# Altium project SVEC.PrjPcb (part 7 of 11)

## Sheet DDR3_2.SchDoc: DDR3 memory
size 420 x 297 mm; CheckedBy: T.Janicki; CompanyName: Creotech Instruments SA; DrawnBy: G.Kasprowicz; Organization: CERN; Address1: European Organization for Nuclear Research; Address2: CH-1211 Geneve 23 - Switzerland; Revision: -; SheetNumber: 4; SheetTotal: 21; EDA_Number: EDA-xxxx; Projet: Simple VME FMC Carrier; ModifiedBy: -; CreateDate: 20/11/2012; CheckedDate: 30/04/2012; Title2: - bank 5 -; DivGrp: BE-CO; Designer: G.Kasprowicz; PageSetup: Record=PageOptions|CenterHorizontal=True|CenterVertical=True|PrintScale=0.95|XCorrection=1.00|YCorrection=1.00|PrintKind=1|BorderSize=5000000|LeftOffset=0|BottomOffset=0|Orientation=2|PaperLength=1000|PaperWidth=1000|Scale=100|PaperSource=15|PrintQuality=600|MediaType=1|DitherType=10|PaperKind=A3|PrintScaleMode=1; ModifiedDate: -
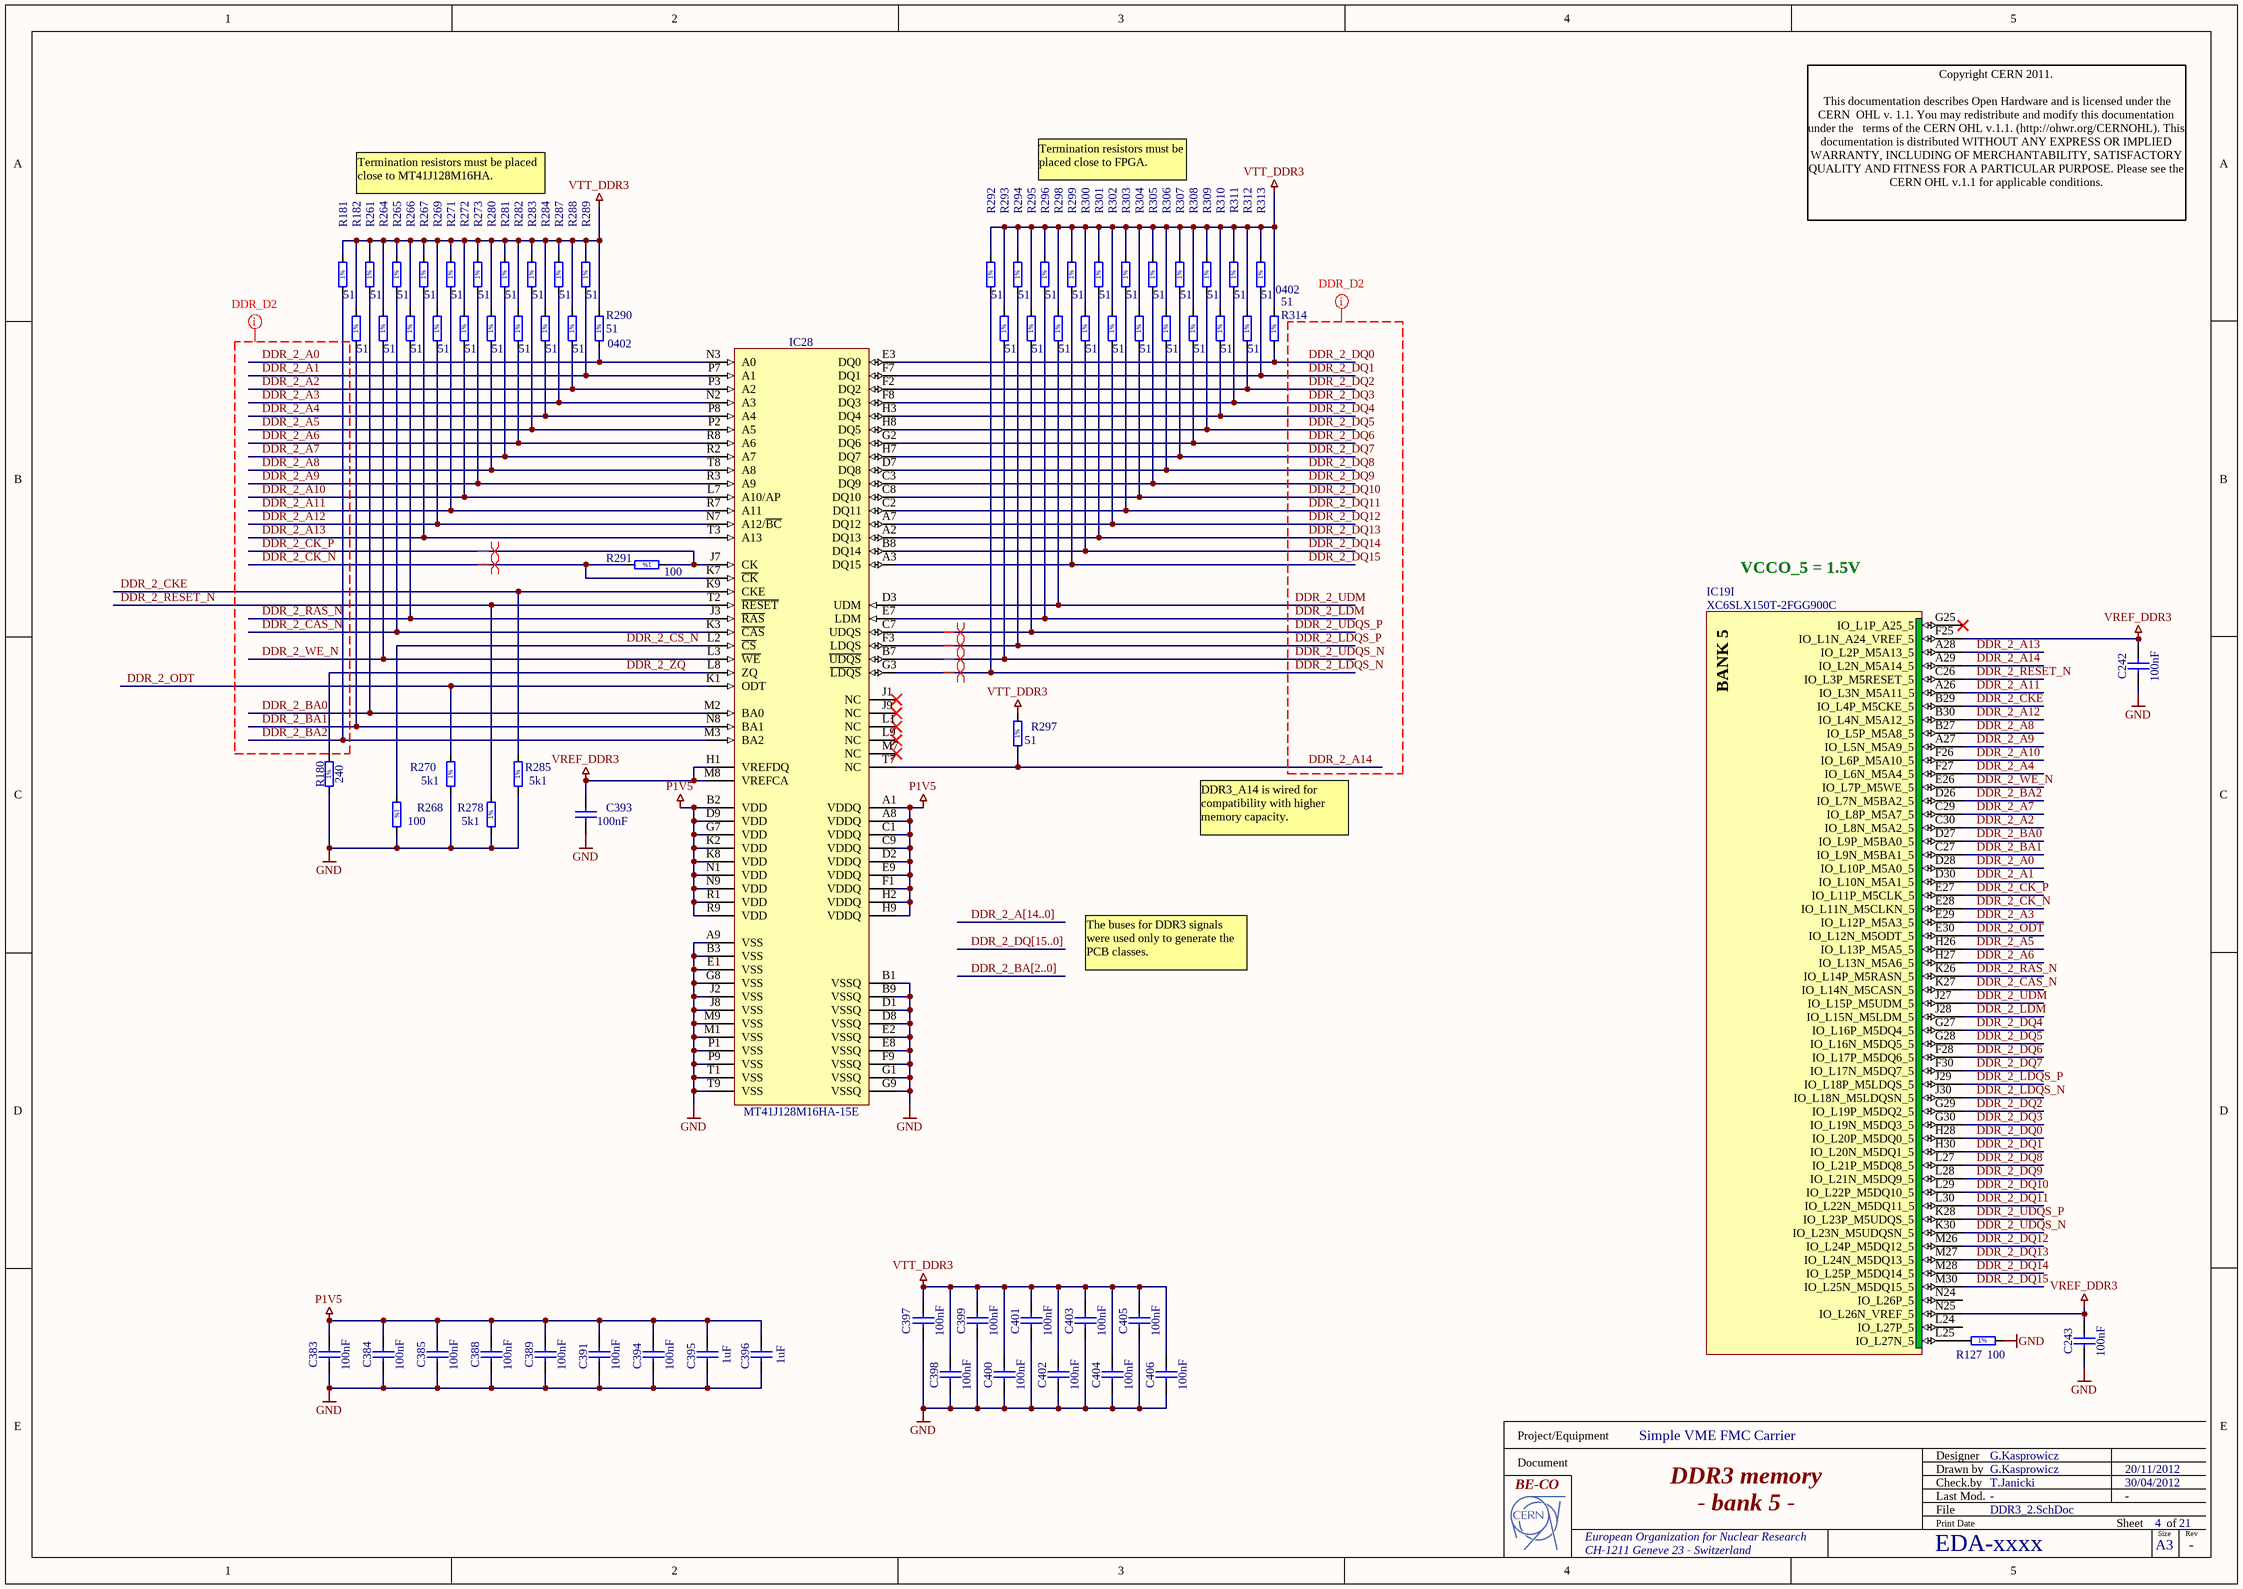
[diagram p11: DDR3_2.SchDoc]

### Parts
C242  100nF  [CAPC1005X55N]
C243  100nF  [CAPC1005X55N]
C383  100nF  [CAPC1005X55N]
C384  100nF  [CAPC1005X55N]
C385  100nF  [CAPC1005X55N]
C388  100nF  [CAPC1005X55N]
C389  100nF  [CAPC1005X55N]
C391  100nF  [CAPC1005X55N]
C393  100nF  [CAPC1005X55N]
C394  100nF  [CAPC1005X55N]
C395  1uF  [CAPC1608X87N]
C396  1uF  [CAPC1608X87N]
C397  100nF  [CAPC1005X55N]
C398  100nF  [CAPC1005X55N]
C399  100nF  [CAPC1005X55N]
C400  100nF  [CAPC1005X55N]
C401  100nF  [CAPC1005X55N]
C402  100nF  [CAPC1005X55N]
C403  100nF  [CAPC1005X55N]
C404  100nF  [CAPC1005X55N]
C405  100nF  [CAPC1005X55N]
C406  100nF  [CAPC1005X55N]
IC19  XC6SLX150T-2FGG900C  [BGA900C100P30X30_3100X3100X260]  (part I of 18)
IC28  MT41J128M16HA-15E  [BGA96C80P9X16_900X1400X120]
R127  100  [RESC1608X55N]
R180  240  [RESC1608X55N]
R181  51  [RESC1005X40N]
R182  51  [RESC1005X40N]
R261  51  [RESC1005X40N]
R264  51  [RESC1005X40N]
R265  51  [RESC1005X40N]
R266  51  [RESC1005X40N]
R267  51  [RESC1005X40N]
R268  100  [RESC1608X55N]
R269  51  [RESC1005X40N]
R270  5k1  [RESC1608X55N]
R271  51  [RESC1005X40N]
R272  51  [RESC1005X40N]
R273  51  [RESC1005X40N]
R278  5k1  [RESC1608X55N]
R280  51  [RESC1005X40N]
R281  51  [RESC1005X40N]
R282  51  [RESC1005X40N]
R283  51  [RESC1005X40N]
R284  51  [RESC1005X40N]
R285  5k1  [RESC1608X55N]
R287  51  [RESC1005X40N]
R288  51  [RESC1005X40N]
R289  51  [RESC1005X40N]
R290  51  Case: 0402  [RESC1005X40N]
R291  100  [RESC1608X55N]
R292  51  [RESC1005X40N]
R293  51  [RESC1005X40N]
R294  51  [RESC1005X40N]
R295  51  [RESC1005X40N]
R296  51  [RESC1005X40N]
R297  51  [RESC1005X40N]
R298  51  [RESC1005X40N]
R299  51  [RESC1005X40N]
R300  51  [RESC1005X40N]
R301  51  [RESC1005X40N]
R302  51  [RESC1005X40N]
R303  51  [RESC1005X40N]
R304  51  [RESC1005X40N]
R305  51  [RESC1005X40N]
R306  51  [RESC1005X40N]
R307  51  [RESC1005X40N]
R308  51  [RESC1005X40N]
R309  51  [RESC1005X40N]
R310  51  [RESC1005X40N]
R311  51  [RESC1005X40N]
R312  51  [RESC1005X40N]
R313  51  [RESC1005X40N]
R314  51  Case: 0402  [RESC1005X40N]

### Nets
GND: C242.1 C243.1 C383.1 C384.1 C385.1 C388.1 C389.1 C391.1 C393.1 C394.1 C395.1 C396.1 C397.1 C398.1 C399.1 C400.1 C401.1 C402.1 C403.1 C404.1 C405.1 C406.1 IC28.A9(VSS) IC28.B1(VSSQ) IC28.B3(VSS) IC28.B9(VSSQ) IC28.D1(VSSQ) IC28.D8(VSSQ) IC28.E1(VSS) IC28.E2(VSSQ) IC28.E8(VSSQ) IC28.F9(VSSQ) IC28.G1(VSSQ) IC28.G8(VSS) IC28.G9(VSSQ) IC28.J2(VSS) IC28.J8(VSS) IC28.M1(VSS) IC28.M9(VSS) IC28.P1(VSS) IC28.P9(VSS) IC28.T1(VSS) IC28.T9(VSS) R127.2 R180.1 R268.2 R270.1 R278.1 R285.1
P1V5: C383.2 C384.2 C385.2 C388.2 C389.2 C391.2 C394.2 C395.2 C396.2 IC28.A1(VDDQ) IC28.A8(VDDQ) IC28.B2(VDD) IC28.C1(VDDQ) IC28.C9(VDDQ) IC28.D2(VDDQ) IC28.D9(VDD) IC28.E9(VDDQ) IC28.F1(VDDQ) IC28.G7(VDD) IC28.H2(VDDQ) IC28.H9(VDDQ) IC28.K2(VDD) IC28.K8(VDD) IC28.N1(VDD) IC28.N9(VDD) IC28.R1(VDD) IC28.R9(VDD)
VREF_DDR3: C242.2 C243.2 C393.2 IC19.F25(IO_L1N_A24_VREF_5) IC19.N25(IO_L26N_VREF_5) IC28.H1(VREFDQ) IC28.M8(VREFCA)
VTT_DDR3: C397.2 C398.2 C399.2 C400.2 C401.2 C402.2 C403.2 C404.2 C405.2 C406.2 R181.2 R182.2 R261.2 R264.2 R265.2 R266.2 R267.2 R269.2 R271.2 R272.2 R273.2 R280.2 R281.2 R282.2 R283.2 R284.2 R287.2 R288.2 R289.2 R290.2 R292.2 R293.2 R294.2 R295.2 R296.2 R297.2 R298.2 R299.2 R300.2 R301.2 R302.2 R303.2 R304.2 R305.2 R306.2 R307.2 R308.2 R309.2 R310.2 R311.2 R312.2 R313.2 R314.2
DDR_2_A0: IC19.D28(IO_L10P_M5A0_5) IC28.N3(A0) R290.1
DDR_2_A1: IC19.D30(IO_L10N_M5A1_5) IC28.P7(A1) R289.1
DDR_2_A2: IC19.C30(IO_L8N_M5A2_5) IC28.P3(A2) R288.1
DDR_2_A3: IC19.E29(IO_L12P_M5A3_5) IC28.N2(A3) R287.1
DDR_2_A4: IC19.F27(IO_L6N_M5A4_5) IC28.P8(A4) R284.1
DDR_2_A5: IC19.H26(IO_L13P_M5A5_5) IC28.P2(A5) R283.1
DDR_2_A6: IC19.H27(IO_L13N_M5A6_5) IC28.R8(A6) R282.1
DDR_2_A7: IC19.C29(IO_L8P_M5A7_5) IC28.R2(A7) R281.1
DDR_2_A8: IC19.B27(IO_L5P_M5A8_5) IC28.T8(A8) R280.1
DDR_2_A9: IC19.A27(IO_L5N_M5A9_5) IC28.R3(A9) R273.1
DDR_2_A10: IC19.F26(IO_L6P_M5A10_5) IC28.L7(A10/AP) R272.1
DDR_2_A11: IC19.A26(IO_L3N_M5A11_5) IC28.R7(A11) R271.1
DDR_2_A12: IC19.B30(IO_L4N_M5A12_5) IC28.N7(A12/~{BC}) R269.1
DDR_2_A13: IC19.A28(IO_L2P_M5A13_5) IC28.T3(A13) R267.1
DDR_2_A14: IC19.A29(IO_L2N_M5A14_5) IC28.T7(NC) R297.1
DDR_2_BA0: IC19.D27(IO_L9P_M5BA0_5) IC28.M2(BA0) R261.1
DDR_2_BA1: IC19.C27(IO_L9N_M5BA1_5) IC28.N8(BA1) R182.1
DDR_2_BA2: IC19.D26(IO_L7N_M5BA2_5) IC28.M3(BA2) R181.1
DDR_2_CAS_N: IC19.K27(IO_L14N_M5CASN_5) IC28.K3(~{CAS}) R265.1
DDR_2_CK_N: IC19.E28(IO_L11N_M5CLKN_5) IC28.K7(~{CK}) R291.2
DDR_2_CK_P: IC19.E27(IO_L11P_M5CLK_5) IC28.J7(CK) R291.1
DDR_2_CKE: IC19.B29(IO_L4P_M5CKE_5) IC28.K9(CKE) R285.2
DDR_2_CS_N: IC28.L2(~{CS}) R268.1
DDR_2_DQ0: IC19.H28(IO_L20P_M5DQ0_5) IC28.E3(DQ0) R314.1
DDR_2_DQ1: IC19.H30(IO_L20N_M5DQ1_5) IC28.F7(DQ1) R313.1
DDR_2_DQ2: IC19.G29(IO_L19P_M5DQ2_5) IC28.F2(DQ2) R312.1
DDR_2_DQ3: IC19.G30(IO_L19N_M5DQ3_5) IC28.F8(DQ3) R311.1
DDR_2_DQ4: IC19.G27(IO_L16P_M5DQ4_5) IC28.H3(DQ4) R310.1
DDR_2_DQ5: IC19.G28(IO_L16N_M5DQ5_5) IC28.H8(DQ5) R309.1
DDR_2_DQ6: IC19.F28(IO_L17P_M5DQ6_5) IC28.G2(DQ6) R308.1
DDR_2_DQ7: IC19.F30(IO_L17N_M5DQ7_5) IC28.H7(DQ7) R307.1
DDR_2_DQ8: IC19.L27(IO_L21P_M5DQ8_5) IC28.D7(DQ8) R306.1
DDR_2_DQ9: IC19.L28(IO_L21N_M5DQ9_5) IC28.C3(DQ9) R305.1
DDR_2_DQ10: IC19.L29(IO_L22P_M5DQ10_5) IC28.C8(DQ10) R304.1
DDR_2_DQ11: IC19.L30(IO_L22N_M5DQ11_5) IC28.C2(DQ11) R303.1
DDR_2_DQ12: IC19.M26(IO_L24P_M5DQ12_5) IC28.A7(DQ12) R302.1
DDR_2_DQ13: IC19.M27(IO_L24N_M5DQ13_5) IC28.A2(DQ13) R301.1
DDR_2_DQ14: IC19.M28(IO_L25P_M5DQ14_5) IC28.B8(DQ14) R300.1
DDR_2_DQ15: IC19.M30(IO_L25N_M5DQ15_5) IC28.A3(DQ15) R299.1
DDR_2_LDM: IC19.J28(IO_L15N_M5LDM_5) IC28.E7(LDM) R296.1
DDR_2_LDQS_N: IC19.J30(IO_L18N_M5LDQSN_5) IC28.G3(~{LDQS}) R292.1
DDR_2_LDQS_P: IC19.J29(IO_L18P_M5LDQS_5) IC28.F3(LDQS) R294.1
DDR_2_ODT: IC19.E30(IO_L12N_M5ODT_5) IC28.K1(ODT) R270.2
DDR_2_RAS_N: IC19.K26(IO_L14P_M5RASN_5) IC28.J3(~{RAS}) R266.1
DDR_2_RESET_N: IC19.C26(IO_L3P_M5RESET_5) IC28.T2(~{RESET}) R278.2
DDR_2_UDM: IC19.J27(IO_L15P_M5UDM_5) IC28.D3(UDM) R298.1
DDR_2_UDQS_N: IC19.K30(IO_L23N_M5UDQSN_5) IC28.B7(~{UDQS}) R293.1
DDR_2_UDQS_P: IC19.K28(IO_L23P_M5UDQS_5) IC28.C7(UDQS) R295.1
DDR_2_WE_N: IC19.E26(IO_L7P_M5WE_5) IC28.L3(~{WE}) R264.1
DDR_2_ZQ: IC28.L8(ZQ) R180.2
NetIC19_L25: IC19.L25(IO_L27N_5) R127.1

Not connected (* = marked no-connect by the designer): IC19 G25(IO_L1P_A25_5)* L24(IO_L27P_5) N24(IO_L26P_5); IC28 J1(NC)* J9(NC)* L1(NC)* L9(NC)* M7(NC)*

### Buses and harness runs
bus DDR_2_A[14..0]
bus DDR_2_BA[2..0]
bus DDR_2_DQ[15..0]

### Layout directives
differential pair: DDR_2_CK_N, DDR_2_CK_P, DDR_2_LDQS_N, DDR_2_LDQS_P, DDR_2_UDQS_N, DDR_2_UDQS_P
net class DDR_D2: DDR_2_A0, DDR_2_A1, DDR_2_A2, DDR_2_A3, DDR_2_A4, DDR_2_A5, DDR_2_A6, DDR_2_A7, DDR_2_A8, DDR_2_A9, DDR_2_A10, DDR_2_A11, DDR_2_A12, DDR_2_A13, DDR_2_A14, DDR_2_BA0, DDR_2_BA1, DDR_2_BA2, DDR_2_CAS_N, DDR_2_CK_N, DDR_2_CK_P, DDR_2_DQ0, DDR_2_DQ1, DDR_2_DQ2, DDR_2_DQ3, DDR_2_DQ4, DDR_2_DQ5, DDR_2_DQ6, DDR_2_DQ7, DDR_2_DQ8, DDR_2_DQ9, DDR_2_DQ10, DDR_2_DQ11, DDR_2_DQ12, DDR_2_DQ13, DDR_2_DQ14, DDR_2_DQ15, DDR_2_LDM, DDR_2_LDQS_N, DDR_2_LDQS_P, DDR_2_RAS_N, DDR_2_UDM, DDR_2_UDQS_N, DDR_2_UDQS_P, DDR_2_WE_N

### Notes on the sheet
- Termination resistors must be placed close to MT41J128M16HA.
- Termination resistors must be placed close to FPGA.
- Copyright CERN 2011.
  This documentation describes Open Hardware and is licensed under the CERN  OHL v. 1.1. You may redistribute and modify this documentation under the   terms of the CERN OHL v.1.1. (http://ohwr.org/CERNOHL). This  documentation is distributed WITHOUT ANY EXPRESS OR IMPLIED  WARRANTY, INCLUDING OF MERCHANTABILITY, SATISFACTORY  QUALITY AND FITNESS FOR A PARTICULAR PURPOSE. Please see the  CERN OHL v.1.1 for applicable conditions.
- VCCO_5 = 1.5V
- DDR3_A14 is wired for compatibility with higher memory capacity.
- The buses for DDR3 signals were used only to generate the PCB classes.
- Project/Equipment
- Document
- Designer
- Drawn by
- Check.by
- File
- Last Mod.
- Print Date
- Sheet
- Size
- A3
- of
- Rev
- (in symbol R0402_51R_1%_0.0625W_100PPM) 1%
- (in symbol R0603_5K1_1%_0.1W_100PPM) 1%
- (in symbol R0603_100R_1%_0.1W_100PPM) 1%
- (in symbol R0603_240R_1%_0.1W_100PPM) 1%
- (in symbol XC6SLX150T-2FGG900C, part I) BANK 5

### Library data of the parts
C242 C243 C391 C394 = CC0402_100NF_16V_10%_X7R: Non-polarised capacitor; Part Description: SMD Multilayer Chip Ceramic Capacitor; Manufacturer: GENERIC; Manufacturer1 Part Number: 223878715649; Voltage: 16V; TC: X7R; Tolerance: ±10%; Table: Capacitors SMD; Part Number: CC0402_100NF_16V_10%_X7R; Component Kind: Standard; Component Type: Standard; Pin Count: 2; Value: 100nF; Status: Not Recommended; Manufacturer Part Number: CC0402_100NF_16V_10%_X7R; Case: 0402; Mounted: Yes; Socket: No; SMD: Yes; Manufacturer1 Example: PHYCOMP; Manufacturer1 ComponentHeight: 0.55mm; HelpURL: \\cern.ch\dfs\Applications\Altium\Datasheets\CC0402_X7R_PHYCOMP.pdf; Author: CERN DEM JLC; CreateDate: 03/12/2007; LatestRevisionDate: 03/12/2007
C383-C385 C388 C389 C393 C397-C406 = CC0402_100NF_16V_10%_X7R: Non-polarised capacitor; Part Description: SMD Multilayer Chip Ceramic Capacitor; Manufacturer: GENERIC; Manufacturer1 Part Number: 223878715649; Manufacturer1 Datasheet: \\cern.ch\dfs\Applications\Altium\Datasheets\CC0402_X7R_PHYCOMP.pdf; Voltage: 16V; TC: X7R; Tolerance: ±10%; Table: Capacitors SMD; Part Number: CC0402_100NF_16V_10%_X7R; Component Kind: Standard; Component Type: Standard; Designator: Capacitor - non polarized; Library Reference: Capacitor - non polarized; Pin Count: 2; Value: 100nF; Status: Not Recommended; Manufacturer Part Number: CC0402_100NF_16V_10%_X7R; Case: 0402; Mounted: Yes; Socket: No; SMD: Yes; Manufacturer1 Example: PHYCOMP; Manufacturer1 ComponentHeight: 0.55mm; HelpURL: \\cern.ch\dfs\Applications\Altium\Datasheets\CC0402_X7R_PHYCOMP.pdf; Author: CERN DEM JLC; CreateDate: 12/3/2007; LatestRevisionDate: 12/3/2007
C395 C396 = CC0603_1UF_16V_10%_X7R: Non-polarised capacitor; Part Description: SMD Multilayer Chip Ceramic Capacitor; Manufacturer: GENERIC; Manufacturer1 Part Number: 223824613663; Voltage: 16V; TC: X7R; Tolerance: ±10%; Table: Capacitors SMD; Part Number: CC0603_1UF_16V_10%_X7R; Component Kind: Standard; Component Type: Standard; Pin Count: 2; Value: 1uF; Status: Preferred; Manufacturer Part Number: CC0603_1uF_16V_10%_X7R; Case: 0603; Mounted: Yes; Socket: No; SMD: Yes; Manufacturer1 Example: PHYCOMP; Manufacturer1 ComponentHeight: 0.87mm; HelpURL: \\cern.ch\dfs\Applications\Altium\Datasheets\CC0805_X5R_PHYCOMP_HC.pdf; Author: CERN DEM JLC; CreateDate: 03/12/2007; LatestRevisionDate: 03/12/2007
IC19 = XC6SLX150T-2FGG900C: SPARTAN-6, FPGA, 900-Ball BGA, Commercial Grade, Pb-Free; Part Description: SPARTAN-6, FPGA, 540 User I/Os, 8 GTPs, 900-Ball BGA, Commercial Grade, Pb-Free; Manufacturer: XILINX; Table: Logic; Part Number: XC6SLX150T-2FGG900C; Component Kind: Standard; Component Type: Standard; Device: XC6SLX150T-2FGG900C; PackageDescription: BGA,1.00mm pitch, square; 900 pin, 30 columns X 30 rows, 31.00mm X 31.00mm X 2.60mm H, IPC Medium Density; Manufacturer Part Number: XC6SLX150T-2FGG900C; Pin Count: 900; Case: BGA900; Mounted: Yes; Socket: No; SMD: Yes; ComponentHeight: 2.6mm; HelpURL: \\cern.ch\dfs\Applications\Altium\Datasheets\XC6SLX150T-2FGG900C.pdf; ComponentLink1URL: \\cern.ch\dfs\Applications\Altium\Datasheets\XC6SLX150T-2FGG900C_Package-Pinouts.pdf; ComponentLink1Description: Package/Pinouts; Author: CERN DEM JLC; CreateDate: 2009-11-17; LatestRevisionDate: 2009-11-17
IC28 = MT41J128M16HA-15E: 16 Meg x 16 x 8 Banks DDR3 SDRAM; Part Description: 16 Meg x 16 x 8 Banks DDR3 SDRAM, +1.5V Supply; Manufacturer: MICRON TECHNOLOGY; Table: Logic; Part Number: MT41J128M16HA-15E; Component Kind: Standard; Component Type: Standard; Designator: MT41J128M16HA; Device: MT41J128M16HA-15E; Library Reference: MT41J128M16HA; PackageDescription: BGA 0.8mm, Pitch, Square 96 Pin, 9 Columns x 16 Rows, Body 14mm X 9mm X 1.2mm H; Manufacturer Part Number: MT41J128M16HA-15E; Pin Count: 96; Case: BGA96; Mounted: Yes; Socket: No; SMD: Yes; ComponentHeight: 1.2mm; Datasheet: \\cern.ch\dfs\Applications\Altium\Datasheets\MT41J128M16HA-15E.pdf; HelpURL: \\cern.ch\dfs\Applications\Altium\Datasheets\MT41J128M16HA-15E.pdf; Author: CERN DEM JLC; CreateDate: 11/19/2009; LatestRevisionDate: 11/19/2009
R127 R268 R291 = R0603_100R_1%_0.1W_100PPM: Resistor - 1%; Part Description: General Purpose Thick Film Chip Resistor; Manufacturer: GENERIC; Manufacturer1 Part Number: NRC06F4700TRF; Power: 0.1W; TC: ±100ppm/°C; Table: Resistors SMD; Part Number: R0603_100R_1%_0.1W_100PPM; Component Kind: Standard; Component Type: Standard; Pin Count: 2; Value: 100; Status: Preferred; Tolerance: ±1%; Manufacturer Part Number: R0603_100R_1%_0.1W_100PPM; Case: 0603; Mounted: Yes; Socket: No; SMD: Yes; Manufacturer1 Example: NIC COMPONENT; Manufacturer1 ComponentHeight: 0.55mm; HelpURL: \\cern.ch\dfs\Applications\Altium\Datasheets\R0603_NIC_NRC.pdf; Author: CERN DEM JLC; CreateDate: 2007-12-03; LatestRevisionDate: 2008-03-13
R180 = R0603_240R_1%_0.1W_100PPM: Resistor - 1%; Part Description: General Purpose Thick Film Chip Resistor; Manufacturer: GENERIC; Manufacturer1 Part Number: NRC06F2400TRF; Power: 0.1W; TC: ±100ppm/°C; Table: Resistors SMD; Part Number: R0603_240R_1%_0.1W_100PPM; Component Kind: Standard; Component Type: Standard; Pin Count: 2; Value: 240; Status: Preferred; Tolerance: ±1%; Manufacturer Part Number: R0603_240R_1%_0.1W_100PPM; Case: 0603; Mounted: Yes; Socket: No; SMD: Yes; Manufacturer1 Example: NIC COMPONENT; Manufacturer1 ComponentHeight: 0.55mm; HelpURL: \\cern.ch\dfs\Applications\Altium\Datasheets\R0603_NIC_NRC.pdf; Author: CERN DEM JLC; CreateDate: 12/3/2007; LatestRevisionDate: 3/13/2008
R181 R182 R261 R264-R267 R269 R271-R273 R280-R284 R287-R290 R292-R314 = R0402_51R_1%_0.0625W_100PPM: Resistor - 1%; Part Description: General Purpose Thick Film Chip Resistor; Manufacturer: GENERIC; Manufacturer1 Part Number: 232270675109; TC: ±100ppm/°C; Table: Resistors SMD; Part Number: R0402_51R_1%_0.0625W_100PPM; Component Kind: Standard; Component Type: Standard; Pin Count: 2; Value: 51; Status: Not recommended; Power: 0.0625W; Tolerance: ±1%; Manufacturer Part Number: R0402_51R_1%_0.0625W_100PPM; Mounted: Yes; Socket: No; SMD: Yes; Manufacturer1 Example: PHYCOMP; Manufacturer1 ComponentHeight: 0.4mm; HelpURL: \\cern.ch\dfs\Applications\Altium\Datasheets\R0402_Phycomp_RC0402.pdf; Author: CERN DEM JLC; CreateDate: 03/12/2007; LatestRevisionDate: 13/03/2008
  R181 R182 R261 R264-R267 R269 R271-R273 R280-R284 R287-R289 R292-R313: Case: 0402
R270 R278 R285 = R0603_5K1_1%_0.1W_100PPM: Resistor - 1%; Part Description: General Purpose Thick Film Chip Resistor; Manufacturer: GENERIC; Manufacturer1 Part Number: NRC06F5101TRF; Power: 0.1W; TC: ±100ppm/°C; Table: Resistors SMD; Part Number: R0603_5K1_1%_0.1W_100PPM; Component Kind: Standard; Component Type: Standard; Pin Count: 2; Value: 5k1; Status: Preferred; Tolerance: ±1%; Manufacturer Part Number: R0603_5K1_1%_0.1W_100PPM; Case: 0603; Mounted: Yes; Socket: No; SMD: Yes; Manufacturer1 Example: NIC COMPONENT; Manufacturer1 ComponentHeight: 0.55mm; HelpURL: \\cern.ch\dfs\Applications\Altium\Datasheets\R0603_NIC_NRC.pdf; Author: CERN DEM JLC; CreateDate: 03/12/2007; LatestRevisionDate: 13/03/2008

## Sheet AFPGA_VME_IO_banks1+3.SchDoc: AFPGA VME & IO
size 420 x 297 mm; CheckedBy: T.Janicki; CompanyName: Creotech Instruments SA; DrawnBy: G.Kasprowicz; Organization: CERN; Address1: European Organization for Nuclear Research; Address2: CH-1211 Genève 23 - Switzerland; Revision: -; SheetNumber: 7; SheetTotal: 19; EDA_Number: EDA-xxxx; Projet: Simple VME FMC Carrier; ModifiedBy: -; CreateDate: 20/11/2012; CheckedDate: 23/01/2012; Title2: - banks 1 & 3 -; DivGrp: BE-CO; Designer: G.Kasprowicz; PageSetup: Record=PageOptions|CenterHorizontal=True|CenterVertical=True|PrintScale=0.95|XCorrection=1.00|YCorrection=1.00|PrintKind=1|BorderSize=5000000|LeftOffset=0|BottomOffset=0|Orientation=2|PaperLength=1000|PaperWidth=1000|Scale=100|PaperSource=15|PrintQuality=600|MediaType=1|DitherType=10|PaperKind=A3|PrintScaleMode=1; ModifiedDate: -
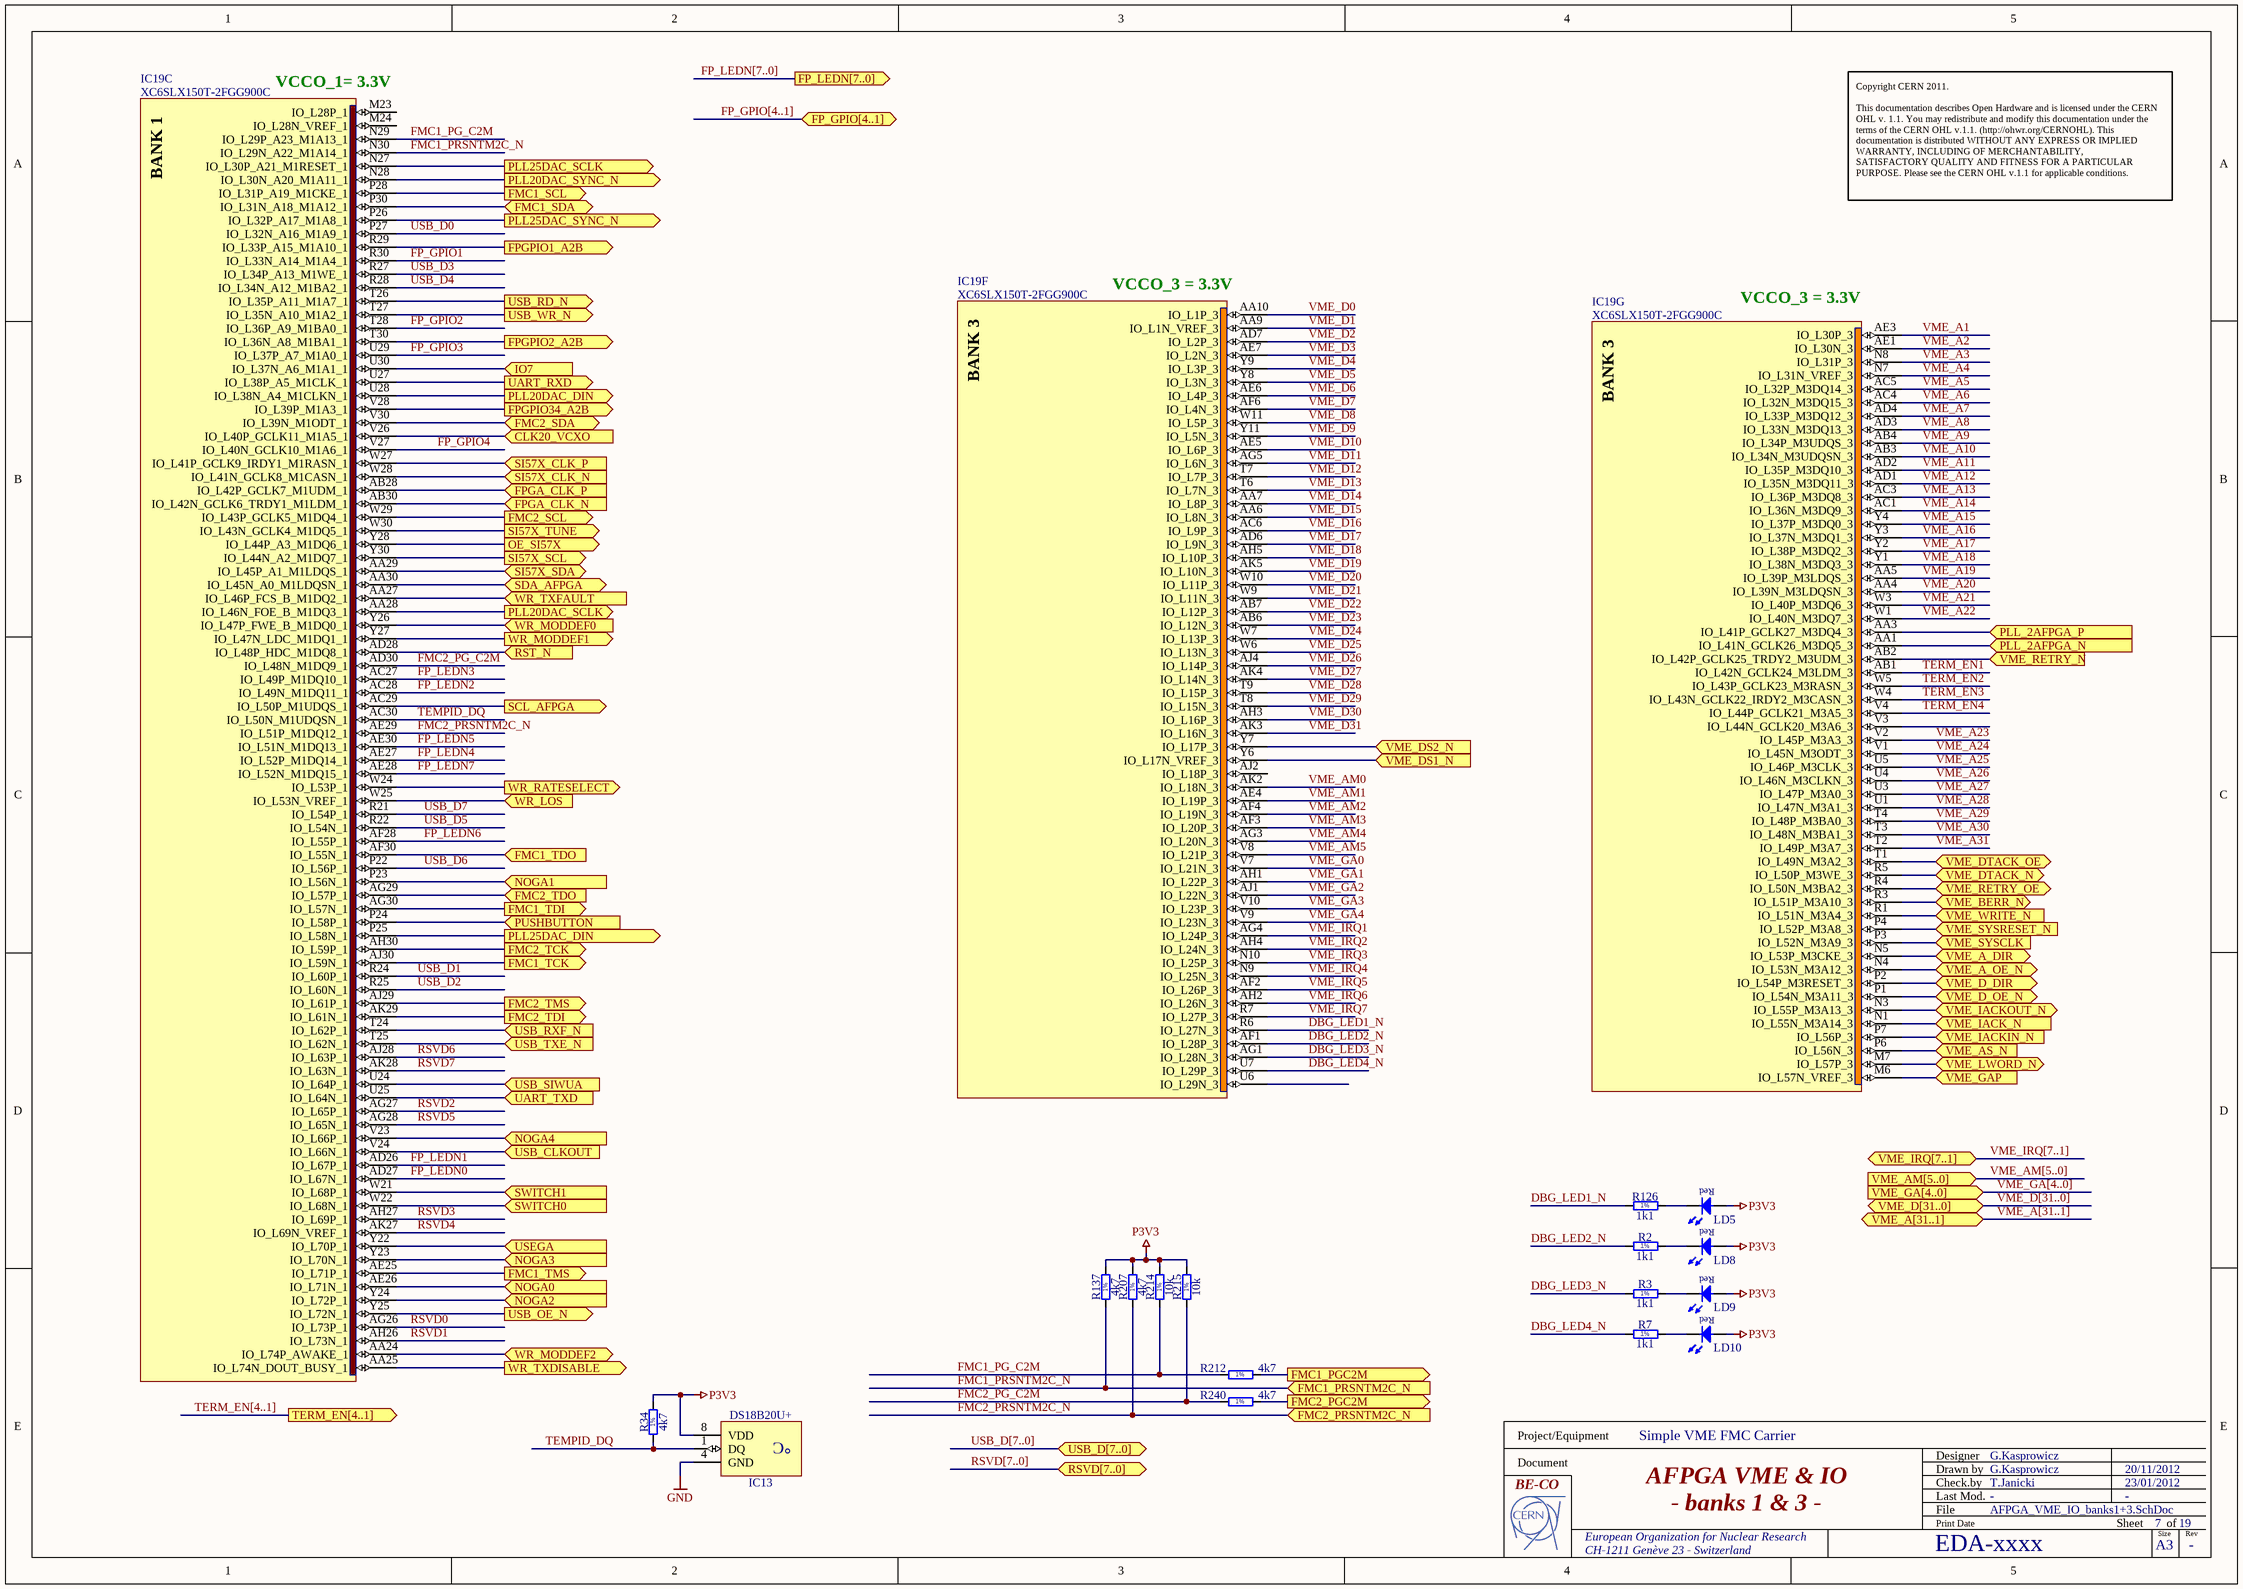
[diagram p12: AFPGA_VME_IO_banks1+3.SchDoc]

### Parts
IC13  DS18B20U+  [SOP65P490X110-8N]
IC19  XC6SLX150T-2FGG900C  [BGA900C100P30X30_3100X3100X260]  (parts C,F,G of 18)
LD5  Red  [LEDC1608X80N_RED]  (value not drawn)
LD8  Red  [LEDC1608X80N_RED]  (value not drawn)
LD9  Red  [LEDC1608X80N_RED]  (value not drawn)
LD10  Red  [LEDC1608X80N_RED]  (value not drawn)
R2  1k1  [RESC1608X55N]
R3  1k1  [RESC1608X55N]
R7  1k1  [RESC1608X55N]
R34  4k7  [RESC1608X55N]
R126  1k1  [RESC1608X55N]
R137  4k7  [RESC1608X55N]
R207  4k7  [RESC1608X55N]
R212  4k7  [RESC1608X55N]
R214  10k  [RESC1608X55N]
R215  10k  [RESC1608X55N]
R240  4k7  [RESC1608X55N]

### Ports
CLK20_VCXO (in), FMC1_PGC2M (out), FMC1_PRSNTM2C_N (in), FMC1_SCL (out), FMC1_SDA (bidir), FMC1_TCK (out), FMC1_TDI (out), FMC1_TDO (in), FMC1_TMS (out), FMC2_PGC2M (out), FMC2_PRSNTM2C_N (in), FMC2_SCL (out), FMC2_SDA (bidir), FMC2_TCK (out), FMC2_TDI (out), FMC2_TDO (in), FMC2_TMS (out), FP_GPIO[4..1] (bidir), FP_LEDN[7..0] (out), FPGA_CLK_N (in), FPGA_CLK_P (in), FPGPIO1_A2B (out), FPGPIO2_A2B (out), FPGPIO34_A2B (out), IO7 (in), NOGA0 (in), NOGA1 (in), NOGA2 (in), NOGA3 (in), NOGA4 (in), OE_SI57X (out), PLL20DAC_DIN (out), PLL20DAC_SCLK (out), PLL20DAC_SYNC_N (out), PLL25DAC_DIN (out), PLL25DAC_SCLK (out), PLL25DAC_SYNC_N (out), PLL_2AFPGA_N (in), PLL_2AFPGA_P (in), PUSHBUTTON (in), RST_N (in), RSVD[7..0] (bidir), SCL_AFPGA (out), SDA_AFPGA (bidir), SI57X_CLK_N (in), SI57X_CLK_P (in), SI57X_SCL (out), SI57X_SDA (bidir), SI57X_TUNE (out), SWITCH0 (in), SWITCH1 (in), TERM_EN[4..1] (out), UART_RXD (out), UART_TXD (in), USB_CLKOUT (in), USB_D[7..0] (bidir), USB_OE_N (out), USB_RD_N (out), USB_RXF_N (in), USB_SIWUA (in), USB_TXE_N (in), USB_WR_N (out), USEGA (in), VME_A[31..1] (bidir), VME_A_DIR (bidir), VME_A_OE_N (bidir), VME_AM[5..0] (in), VME_AS_N (in), VME_BERR_N (bidir), VME_D[31..0] (bidir), VME_D_DIR (bidir), VME_D_OE_N (bidir), VME_DS1_N (in), VME_DS2_N (in), VME_DTACK_N (bidir), VME_DTACK_OE (bidir), VME_GA[4..0] (in), VME_GAP (in), VME_IACK_N (in), VME_IACKIN_N (in), VME_IACKOUT_N (bidir), VME_IRQ[7..1] (bidir), VME_LWORD_N (bidir), VME_RETRY_N (in), VME_RETRY_OE (bidir), VME_SYSCLK (in), VME_SYSRESET_N (in), VME_WRITE_N (in), WR_LOS (in), WR_MODDEF0 (in), WR_MODDEF1 (out), WR_MODDEF2 (bidir), WR_RATESELECT (out), WR_TXDISABLE (out), WR_TXFAULT (in)

### Nets
GND: IC13.4(GND)
P3V3: IC13.8(VDD) LD5.2(A) LD8.2(A) LD9.2(A) LD10.2(A) R34.2 R137.2 R207.2 R214.2 R215.2
CLK20_VCXO: IC19.V26(IO_L40P_GCLK11_M1A5_1) ; port CLK20_VCXO
DBG_LED1_N: IC19.R6(IO_L27N_3) R126.1
DBG_LED2_N: IC19.AF1(IO_L28P_3) R2.1
DBG_LED3_N: IC19.AG1(IO_L28N_3) R3.1
DBG_LED4_N: IC19.U7(IO_L29P_3) R7.1
FMC1_PG_C2M: IC19.N29(IO_L29P_A23_M1A13_1) R212.1 R214.1
FMC1_PGC2M: R212.2 ; port FMC1_PGC2M
FMC1_PRSNTM2C_N: IC19.N30(IO_L29N_A22_M1A14_1) R137.1 ; port FMC1_PRSNTM2C_N
FMC1_SCL: IC19.P28(IO_L31P_A19_M1CKE_1) ; port FMC1_SCL
FMC1_SDA: IC19.P30(IO_L31N_A18_M1A12_1) ; port FMC1_SDA
FMC1_TCK: IC19.AJ30(IO_L59N_1) ; port FMC1_TCK
FMC1_TDI: IC19.AG30(IO_L57N_1) ; port FMC1_TDI
FMC1_TDO: IC19.AF30(IO_L55N_1) ; port FMC1_TDO
FMC1_TMS: IC19.AE25(IO_L71P_1) ; port FMC1_TMS
FMC2_PG_C2M: IC19.AD30(IO_L48N_M1DQ9_1) R215.1 R240.1
FMC2_PGC2M: R240.2 ; port FMC2_PGC2M
FMC2_PRSNTM2C_N: IC19.AE29(IO_L51P_M1DQ12_1) R207.1 ; port FMC2_PRSNTM2C_N
FMC2_SCL: IC19.W29(IO_L43P_GCLK5_M1DQ4_1) ; port FMC2_SCL
FMC2_SDA: IC19.V30(IO_L39N_M1ODT_1) ; port FMC2_SDA
FMC2_TCK: IC19.AH30(IO_L59P_1) ; port FMC2_TCK
FMC2_TDI: IC19.AK29(IO_L61N_1) ; port FMC2_TDI
FMC2_TDO: IC19.AG29(IO_L57P_1) ; port FMC2_TDO
FMC2_TMS: IC19.AJ29(IO_L61P_1) ; port FMC2_TMS
FP_GPIO1: IC19.R30(IO_L33N_A14_M1A4_1)
FP_GPIO2: IC19.T28(IO_L36P_A9_M1BA0_1)
FP_GPIO3: IC19.U29(IO_L37P_A7_M1A0_1)
FP_GPIO4: IC19.V27(IO_L40N_GCLK10_M1A6_1)
FP_LEDN0: IC19.AD27(IO_L67N_1)
FP_LEDN1: IC19.AD26(IO_L67P_1)
FP_LEDN2: IC19.AC28(IO_L49N_M1DQ11_1)
FP_LEDN3: IC19.AC27(IO_L49P_M1DQ10_1)
FP_LEDN4: IC19.AE27(IO_L52P_M1DQ14_1)
FP_LEDN5: IC19.AE30(IO_L51N_M1DQ13_1)
FP_LEDN6: IC19.AF28(IO_L55P_1)
FP_LEDN7: IC19.AE28(IO_L52N_M1DQ15_1)
FPGA_CLK_N: IC19.AB30(IO_L42N_GCLK6_TRDY1_M1LDM_1) ; port FPGA_CLK_N
FPGA_CLK_P: IC19.AB28(IO_L42P_GCLK7_M1UDM_1) ; port FPGA_CLK_P
FPGPIO1_A2B: IC19.R29(IO_L33P_A15_M1A10_1) ; port FPGPIO1_A2B
FPGPIO2_A2B: IC19.T30(IO_L36N_A8_M1BA1_1) ; port FPGPIO2_A2B
FPGPIO34_A2B: IC19.V28(IO_L39P_M1A3_1) ; port FPGPIO34_A2B
IO7: IC19.U30(IO_L37N_A6_M1A1_1) ; port IO7
NOGA0: IC19.AE26(IO_L71N_1) ; port NOGA0
NOGA1: IC19.P23(IO_L56N_1) ; port NOGA1
NOGA2: IC19.Y24(IO_L72P_1) ; port NOGA2
NOGA3: IC19.Y23(IO_L70N_1) ; port NOGA3
NOGA4: IC19.V23(IO_L66P_1) ; port NOGA4
OE_SI57X: IC19.Y28(IO_L44P_A3_M1DQ6_1) ; port OE_SI57X
PLL20DAC_DIN: IC19.U28(IO_L38N_A4_M1CLKN_1) ; port PLL20DAC_DIN
PLL20DAC_SCLK: IC19.AA28(IO_L46N_FOE_B_M1DQ3_1) ; port PLL20DAC_SCLK
PLL20DAC_SYNC_N: IC19.N28(IO_L30N_A20_M1A11_1) ; port PLL20DAC_SYNC_N
PLL25DAC_DIN: IC19.P25(IO_L58N_1) ; port PLL25DAC_DIN
PLL25DAC_SCLK: IC19.N27(IO_L30P_A21_M1RESET_1) ; port PLL25DAC_SCLK
PLL25DAC_SYNC_N: IC19.P26(IO_L32P_A17_M1A8_1) ; port PLL25DAC_SYNC_N
PLL_2AFPGA_N: IC19.AA1(IO_L41N_GCLK26_M3DQ5_3) ; port PLL_2AFPGA_N
PLL_2AFPGA_P: IC19.AA3(IO_L41P_GCLK27_M3DQ4_3) ; port PLL_2AFPGA_P
PUSHBUTTON: IC19.P24(IO_L58P_1) ; port PUSHBUTTON
RST_N: IC19.AD28(IO_L48P_HDC_M1DQ8_1) ; port RST_N
RSVD0: IC19.AG26(IO_L73P_1)
RSVD1: IC19.AH26(IO_L73N_1)
RSVD2: IC19.AG27(IO_L65P_1)
RSVD3: IC19.AH27(IO_L69P_1)
RSVD4: IC19.AK27(IO_L69N_VREF_1)
RSVD5: IC19.AG28(IO_L65N_1)
RSVD6: IC19.AJ28(IO_L63P_1)
RSVD7: IC19.AK28(IO_L63N_1)
SCL_AFPGA: IC19.AC29(IO_L50P_M1UDQS_1) ; port SCL_AFPGA
SDA_AFPGA: IC19.AA30(IO_L45N_A0_M1LDQSN_1) ; port SDA_AFPGA
SI57X_CLK_N: IC19.W28(IO_L41N_GCLK8_M1CASN_1) ; port SI57X_CLK_N
SI57X_CLK_P: IC19.W27(IO_L41P_GCLK9_IRDY1_M1RASN_1) ; port SI57X_CLK_P
SI57X_SCL: IC19.Y30(IO_L44N_A2_M1DQ7_1) ; port SI57X_SCL
SI57X_SDA: IC19.AA29(IO_L45P_A1_M1LDQS_1) ; port SI57X_SDA
SI57X_TUNE: IC19.W30(IO_L43N_GCLK4_M1DQ5_1) ; port SI57X_TUNE
SWITCH0: IC19.W22(IO_L68N_1) ; port SWITCH0
SWITCH1: IC19.W21(IO_L68P_1) ; port SWITCH1
TEMPID_DQ: IC13.1(DQ) IC19.AC30(IO_L50N_M1UDQSN_1) R34.1
TERM_EN1: IC19.AB1(IO_L42N_GCLK24_M3LDM_3)
TERM_EN2: IC19.W5(IO_L43P_GCLK23_M3RASN_3)
TERM_EN3: IC19.W4(IO_L43N_GCLK22_IRDY2_M3CASN_3)
TERM_EN4: IC19.V4(IO_L44P_GCLK21_M3A5_3)
UART_RXD: IC19.U27(IO_L38P_A5_M1CLK_1) ; port UART_RXD
UART_TXD: IC19.U25(IO_L64N_1) ; port UART_TXD
USB_CLKOUT: IC19.V24(IO_L66N_1) ; port USB_CLKOUT
USB_D0: IC19.P27(IO_L32N_A16_M1A9_1)
USB_D1: IC19.R24(IO_L60P_1)
USB_D2: IC19.R25(IO_L60N_1)
USB_D3: IC19.R27(IO_L34P_A13_M1WE_1)
USB_D4: IC19.R28(IO_L34N_A12_M1BA2_1)
USB_D5: IC19.R22(IO_L54N_1)
USB_D6: IC19.P22(IO_L56P_1)
USB_D7: IC19.R21(IO_L54P_1)
USB_OE_N: IC19.Y25(IO_L72N_1) ; port USB_OE_N
USB_RD_N: IC19.T26(IO_L35P_A11_M1A7_1) ; port USB_RD_N
USB_RXF_N: IC19.T24(IO_L62P_1) ; port USB_RXF_N
USB_SIWUA: IC19.U24(IO_L64P_1) ; port USB_SIWUA
USB_TXE_N: IC19.T25(IO_L62N_1) ; port USB_TXE_N
USB_WR_N: IC19.T27(IO_L35N_A10_M1A2_1) ; port USB_WR_N
USEGA: IC19.Y22(IO_L70P_1) ; port USEGA
VME_A1: IC19.AE3(IO_L30P_3)
VME_A2: IC19.AE1(IO_L30N_3)
VME_A3: IC19.N8(IO_L31P_3)
VME_A4: IC19.N7(IO_L31N_VREF_3)
VME_A5: IC19.AC5(IO_L32P_M3DQ14_3)
VME_A6: IC19.AC4(IO_L32N_M3DQ15_3)
VME_A7: IC19.AD4(IO_L33P_M3DQ12_3)
VME_A8: IC19.AD3(IO_L33N_M3DQ13_3)
VME_A9: IC19.AB4(IO_L34P_M3UDQS_3)
VME_A10: IC19.AB3(IO_L34N_M3UDQSN_3)
VME_A11: IC19.AD2(IO_L35P_M3DQ10_3)
VME_A12: IC19.AD1(IO_L35N_M3DQ11_3)
VME_A13: IC19.AC3(IO_L36P_M3DQ8_3)
VME_A14: IC19.AC1(IO_L36N_M3DQ9_3)
VME_A15: IC19.Y4(IO_L37P_M3DQ0_3)
VME_A16: IC19.Y3(IO_L37N_M3DQ1_3)
VME_A17: IC19.Y2(IO_L38P_M3DQ2_3)
VME_A18: IC19.Y1(IO_L38N_M3DQ3_3)
VME_A19: IC19.AA5(IO_L39P_M3LDQS_3)
VME_A20: IC19.AA4(IO_L39N_M3LDQSN_3)
VME_A21: IC19.W3(IO_L40P_M3DQ6_3)
VME_A22: IC19.W1(IO_L40N_M3DQ7_3)
VME_A23: IC19.V2(IO_L45P_M3A3_3)
VME_A24: IC19.V1(IO_L45N_M3ODT_3)
VME_A25: IC19.U5(IO_L46P_M3CLK_3)
VME_A26: IC19.U4(IO_L46N_M3CLKN_3)
VME_A27: IC19.U3(IO_L47P_M3A0_3)
VME_A28: IC19.U1(IO_L47N_M3A1_3)
VME_A29: IC19.T4(IO_L48P_M3BA0_3)
VME_A30: IC19.T3(IO_L48N_M3BA1_3)
VME_A31: IC19.T2(IO_L49P_M3A7_3)
VME_A_DIR: IC19.N5(IO_L53P_M3CKE_3) ; port VME_A_DIR
VME_A_OE_N: IC19.N4(IO_L53N_M3A12_3) ; port VME_A_OE_N
VME_AM0: IC19.AK2(IO_L18N_3)
VME_AM1: IC19.AE4(IO_L19P_3)
VME_AM2: IC19.AF4(IO_L19N_3)
VME_AM3: IC19.AF3(IO_L20P_3)
VME_AM4: IC19.AG3(IO_L20N_3)
VME_AM5: IC19.V8(IO_L21P_3)
VME_AS_N: IC19.P6(IO_L56N_3) ; port VME_AS_N
VME_BERR_N: IC19.R3(IO_L51P_M3A10_3) ; port VME_BERR_N
VME_D0: IC19.AA10(IO_L1P_3)
VME_D1: IC19.AA9(IO_L1N_VREF_3)
VME_D2: IC19.AD7(IO_L2P_3)
VME_D3: IC19.AE7(IO_L2N_3)
VME_D4: IC19.Y9(IO_L3P_3)
VME_D5: IC19.Y8(IO_L3N_3)
VME_D6: IC19.AE6(IO_L4P_3)
VME_D7: IC19.AF6(IO_L4N_3)
VME_D8: IC19.W11(IO_L5P_3)
VME_D9: IC19.Y11(IO_L5N_3)
VME_D10: IC19.AE5(IO_L6P_3)
VME_D11: IC19.AG5(IO_L6N_3)
VME_D12: IC19.T7(IO_L7P_3)
VME_D13: IC19.T6(IO_L7N_3)
VME_D14: IC19.AA7(IO_L8P_3)
VME_D15: IC19.AA6(IO_L8N_3)
VME_D16: IC19.AC6(IO_L9P_3)
VME_D17: IC19.AD6(IO_L9N_3)
VME_D18: IC19.AH5(IO_L10P_3)
VME_D19: IC19.AK5(IO_L10N_3)
VME_D20: IC19.W10(IO_L11P_3)
VME_D21: IC19.W9(IO_L11N_3)
VME_D22: IC19.AB7(IO_L12P_3)
VME_D23: IC19.AB6(IO_L12N_3)
VME_D24: IC19.W7(IO_L13P_3)
VME_D25: IC19.W6(IO_L13N_3)
VME_D26: IC19.AJ4(IO_L14P_3)
VME_D27: IC19.AK4(IO_L14N_3)
VME_D28: IC19.T9(IO_L15P_3)
VME_D29: IC19.T8(IO_L15N_3)
VME_D30: IC19.AH3(IO_L16P_3)
VME_D31: IC19.AK3(IO_L16N_3)
VME_D_DIR: IC19.P2(IO_L54P_M3RESET_3) ; port VME_D_DIR
VME_D_OE_N: IC19.P1(IO_L54N_M3A11_3) ; port VME_D_OE_N
VME_DS1_N: IC19.Y6(IO_L17N_VREF_3) ; port VME_DS1_N
VME_DS2_N: IC19.Y7(IO_L17P_3) ; port VME_DS2_N
VME_DTACK_N: IC19.R5(IO_L50P_M3WE_3) ; port VME_DTACK_N
VME_DTACK_OE: IC19.T1(IO_L49N_M3A2_3) ; port VME_DTACK_OE
VME_GA0: IC19.V7(IO_L21N_3)
VME_GA1: IC19.AH1(IO_L22P_3)
VME_GA2: IC19.AJ1(IO_L22N_3)
VME_GA3: IC19.V10(IO_L23P_3)
VME_GA4: IC19.V9(IO_L23N_3)
VME_GAP: IC19.M6(IO_L57N_VREF_3) ; port VME_GAP
VME_IACK_N: IC19.N1(IO_L55N_M3A14_3) ; port VME_IACK_N
VME_IACKIN_N: IC19.P7(IO_L56P_3) ; port VME_IACKIN_N
VME_IACKOUT_N: IC19.N3(IO_L55P_M3A13_3) ; port VME_IACKOUT_N
VME_IRQ1: IC19.AG4(IO_L24P_3)
VME_IRQ2: IC19.AH4(IO_L24N_3)
VME_IRQ3: IC19.N10(IO_L25P_3)
VME_IRQ4: IC19.N9(IO_L25N_3)
VME_IRQ5: IC19.AF2(IO_L26P_3)
VME_IRQ6: IC19.AH2(IO_L26N_3)
VME_IRQ7: IC19.R7(IO_L27P_3)
VME_LWORD_N: IC19.M7(IO_L57P_3) ; port VME_LWORD_N
VME_RETRY_N: IC19.AB2(IO_L42P_GCLK25_TRDY2_M3UDM_3) ; port VME_RETRY_N
VME_RETRY_OE: IC19.R4(IO_L50N_M3BA2_3) ; port VME_RETRY_OE
VME_SYSCLK: IC19.P3(IO_L52N_M3A9_3) ; port VME_SYSCLK
VME_SYSRESET_N: IC19.P4(IO_L52P_M3A8_3) ; port VME_SYSRESET_N
VME_WRITE_N: IC19.R1(IO_L51N_M3A4_3) ; port VME_WRITE_N
WR_LOS: IC19.W25(IO_L53N_VREF_1) ; port WR_LOS
WR_MODDEF0: IC19.Y26(IO_L47P_FWE_B_M1DQ0_1) ; port WR_MODDEF0
WR_MODDEF1: IC19.Y27(IO_L47N_LDC_M1DQ1_1) ; port WR_MODDEF1
WR_MODDEF2: IC19.AA24(IO_L74P_AWAKE_1) ; port WR_MODDEF2
WR_RATESELECT: IC19.W24(IO_L53P_1) ; port WR_RATESELECT
WR_TXDISABLE: IC19.AA25(IO_L74N_DOUT_BUSY_1) ; port WR_TXDISABLE
WR_TXFAULT: IC19.AA27(IO_L46P_FCS_B_M1DQ2_1) ; port WR_TXFAULT
NetLD5_1: LD5.1(C) R126.2
NetLD8_1: LD8.1(C) R2.2
NetLD9_1: LD9.1(C) R3.2
NetLD10_1: LD10.1(C) R7.2

Not connected (* = marked no-connect by the designer): IC19 AJ2(IO_L18P_3) M23(IO_L28P_1) M24(IO_L28N_VREF_1) U6(IO_L29N_3) V3(IO_L44N_GCLK20_M3A6_3)

### Buses and harness runs
bus FP_GPIO[4..1] = port FP_GPIO[4..1]
bus FP_LEDN[7..0] = port FP_LEDN[7..0]
bus RSVD[7..0] = port RSVD[7..0]
bus TERM_EN[4..1] = port TERM_EN[4..1]
bus USB_D[7..0] = port USB_D[7..0]
bus VME_A[31..1] = port VME_A[31..1]
bus VME_AM[5..0] = port VME_AM[5..0]
bus VME_D[31..0] = port VME_D[31..0]
bus VME_GA[4..0] = port VME_GA[4..0]
bus VME_IRQ[7..1] = port VME_IRQ[7..1]

### Notes on the sheet
- (near IC19) VCCO_1= 3.3V
- Copyright CERN 2011.
  This documentation describes Open Hardware and is licensed under the CERN OHL v. 1.1. You may redistribute and modify this documentation under the terms of the CERN OHL v.1.1. (http://ohwr.org/CERNOHL). This documentation is distributed WITHOUT ANY EXPRESS OR IMPLIED WARRANTY, INCLUDING OF MERCHANTABILITY, SATISFACTORY QUALITY AND FITNESS FOR A PARTICULAR PURPOSE. Please see the CERN OHL v.1.1 for applicable conditions.
- (near IC19) VCCO_3 = 3.3V
- Project/Equipment
- Document
- Designer
- Drawn by
- Check.by
- File
- Last Mod.
- Print Date
- Sheet
- Size
- A3
- of
- Rev
- (in symbol DS18B20U+) °C
- (in symbol R0603_1K1_1%_0.1W_100PPM) 1%
- (in symbol R0603_4K7_1%_0.1W_100PPM) 1%
- (in symbol R0603_10K_1%_0.1W_100PPM) 1%
- (in symbol XC6SLX150T-2FGG900C, part C) BANK 1
- (in symbol XC6SLX150T-2FGG900C, part F) BANK 3
- (in symbol XC6SLX150T-2FGG900C, part G) BANK 3

### Library data of the parts
IC13 = DS18B20U+: Programmable Resolution 1-Wire Digital Thermometer; Part Description: Programmable Resolution 1-Wire Digital Thermometer (-55°C to +125°C); Manufacturer: DALLAS MAXIM; Table: Sensors; Part Number: DS18B20U+; Component Kind: Standard; Component Type: Standard; Device: DS18B20U+; PackageDescription: SOP, 0.65mm pitch; 8 pin, 3.00mm W X 3.00mm L X 1.10mm H body, IPC Medium Density; Manufacturer Part Number: DS18B20U+; Pin Count: 3; Case: uSOP8; Mounted: Yes; Socket: No; SMD: Yes; ComponentHeight: 1.1mm; HelpURL: \\cern.ch\dfs\Applications\Altium\Datasheets\DS18B20U+.pdf; Author: CERN DEM JLC; CreateDate: 3/17/2010; LatestRevisionDate: 3/17/2010
IC19 = XC6SLX150T-2FGG900C: as IC19 on sheet DDR3_2; Part Number: XC6SLX150T-2FGG900C; Component Kind: Standard; Component Type: Standard; Device: XC6SLX150T-2FGG900C; PackageDescription: BGA,1.00mm pitch, square; 900 pin, 30 columns X 30 rows, 31.00mm X 31.00mm X 2.60mm H, IPC Medium Density; Manufacturer Part Number: XC6SLX150T-2FGG900C; Pin Count: 900; Case: BGA900; Mounted: Yes; Socket: No; SMD: Yes; ComponentHeight: 2.6mm; HelpURL: \\cern.ch\dfs\Applications\Altium\Datasheets\XC6SLX150T-2FGG900C.pdf; ComponentLink1URL: \\cern.ch\dfs\Applications\Altium\Datasheets\XC6SLX150T-2FGG900C_Package-Pinouts.pdf; ComponentLink1Description: Package/Pinouts; Author: CERN DEM JLC; CreateDate: 2009-11-17; LatestRevisionDate: 2009-11-17
LD5 LD8-LD10 = LED_ROHM_SML-311UTT86K: LED Red 1C 2A; Part Description: Low current chip LED SML-311 Serie; Manufacturer: ROHM; Table: LEDs & Displays; Part Number: LED_ROHM_SML-311UTT86K; Component Kind: Standard; Component Type: Standard; Color: Red; PackageDescription: Chip RED LED, 2-Leads, Body 1.6x0.8mm, IPC Medium Density; Manufacturer Part Number: SML-311UTT86K; Pin Count: 2; Mounted: Yes; Socket: No; SMD: Yes; ComponentHeight: 0.8mm; HelpURL: \\cern.ch\dfs\Applications\Altium\Datasheets\LED_ROHM_SML-311UTT86K.pdf; Author: CERN DEM JLC; CreateDate: 3/16/2010; LatestRevisionDate: 3/17/2010
R2 R3 R7 R126 = R0603_1K1_1%_0.1W_100PPM: Resistor - 1%; Part Description: General Purpose Thick Film Chip Resistor; Manufacturer: GENERIC; Manufacturer1 Part Number: NRC06F1101TRF; Power: 0.1W; TC: ±100ppm/°C; Table: Resistors SMD; Part Number: R0603_1K1_1%_0.1W_100PPM; Component Kind: Standard; Component Type: Standard; Pin Count: 2; Value: 1k1; Status: Preferred; Tolerance: ±1%; Manufacturer Part Number: R0603_1K1_1%_0.1W_100PPM; Case: 0603; Mounted: Yes; Socket: No; SMD: Yes; Manufacturer1 Example: NIC COMPONENT; Manufacturer1 ComponentHeight: 0.55mm; HelpURL: \\cern.ch\dfs\Applications\Altium\Datasheets\R0603_NIC_NRC.pdf; Author: CERN DEM JLC; CreateDate: 2007-12-03; LatestRevisionDate: 2008-03-13
R34 R137 R207 R212 R240 = R0603_4K7_1%_0.1W_100PPM: Resistor - 1%; Part Description: General Purpose Thick Film Chip Resistor; Manufacturer: GENERIC; Manufacturer1 Part Number: NRC06F4701TRF; Power: 0.1W; TC: ±100ppm/°C; Table: Resistors SMD; Part Number: R0603_4K7_1%_0.1W_100PPM; Component Kind: Standard; Component Type: Standard; Pin Count: 2; Value: 4k7; Status: Preferred; Tolerance: ±1%; Manufacturer Part Number: R0603_4K7_1%_0.1W_100PPM; Case: 0603; Mounted: Yes; Socket: No; SMD: Yes; Manufacturer1 Example: NIC COMPONENT; Manufacturer1 ComponentHeight: 0.55mm; HelpURL: \\cern.ch\dfs\Applications\Altium\Datasheets\R0603_NIC_NRC.pdf; Author: CERN DEM JLC
  R34 R212 R240: CreateDate: 03/12/2007; LatestRevisionDate: 13/03/2008
  R137 R207: CreateDate: 2007-12-03; LatestRevisionDate: 2008-03-13
R214 R215 = R0603_10K_1%_0.1W_100PPM: Resistor - 1%; Part Description: General Purpose Thick Film Chip Resistor; Manufacturer: GENERIC; Manufacturer1 Part Number: NRC06F1002TRF; Power: 0.1W; TC: ±100ppm/°C; Table: Resistors SMD; Part Number: R0603_10K_1%_0.1W_100PPM; Component Kind: Standard; Component Type: Standard; Pin Count: 2; Value: 10k; Status: Preferred; Tolerance: ±1%; Manufacturer Part Number: R0603_10K_1%_0.1W_100PPM; Case: 0603; Mounted: Yes; Socket: No; SMD: Yes; Manufacturer1 Example: NIC COMPONENT; Manufacturer1 ComponentHeight: 0.55mm; HelpURL: \\cern.ch\dfs\Applications\Altium\Datasheets\R0603_NIC_NRC.pdf; Author: CERN DEM JLC; CreateDate: 2007-12-03; LatestRevisionDate: 2008-03-13

## Sheet VME_connectors.SchDoc: VME connectors
size 420 x 297 mm; CheckedBy: T.Janicki; Author: G.Kasprowicz; CompanyName: Creotech Instruments SA; DrawnBy: G.Kasprowicz; Organization: CERN; Address1: European Organization for Nuclear Research; Address2: CH-1211 Geneve 23 - Switzerland; Revision: -; SheetNumber: 18; SheetTotal: 21; EDA_Number: EDA-xxxx; Projet: Simple VME FMC Carrier; ModifiedBy: -; CreateDate: 26/04/2012; CheckedDate: 30/04/2012; DivGrp: BE-CO; Designer: G.Kasprowicz; PageSetup: Record=PageOptions|CenterHorizontal=True|CenterVertical=True|PrintScale=0.95|XCorrection=1.00|YCorrection=1.00|PrintKind=1|BorderSize=5000000|LeftOffset=0|BottomOffset=0|Orientation=2|PaperLength=1000|PaperWidth=1000|Scale=100|PaperSource=15|PrintQuality=600|MediaType=1|DitherType=10|PaperKind=A3|PrintScaleMode=1; ModifiedDate: -
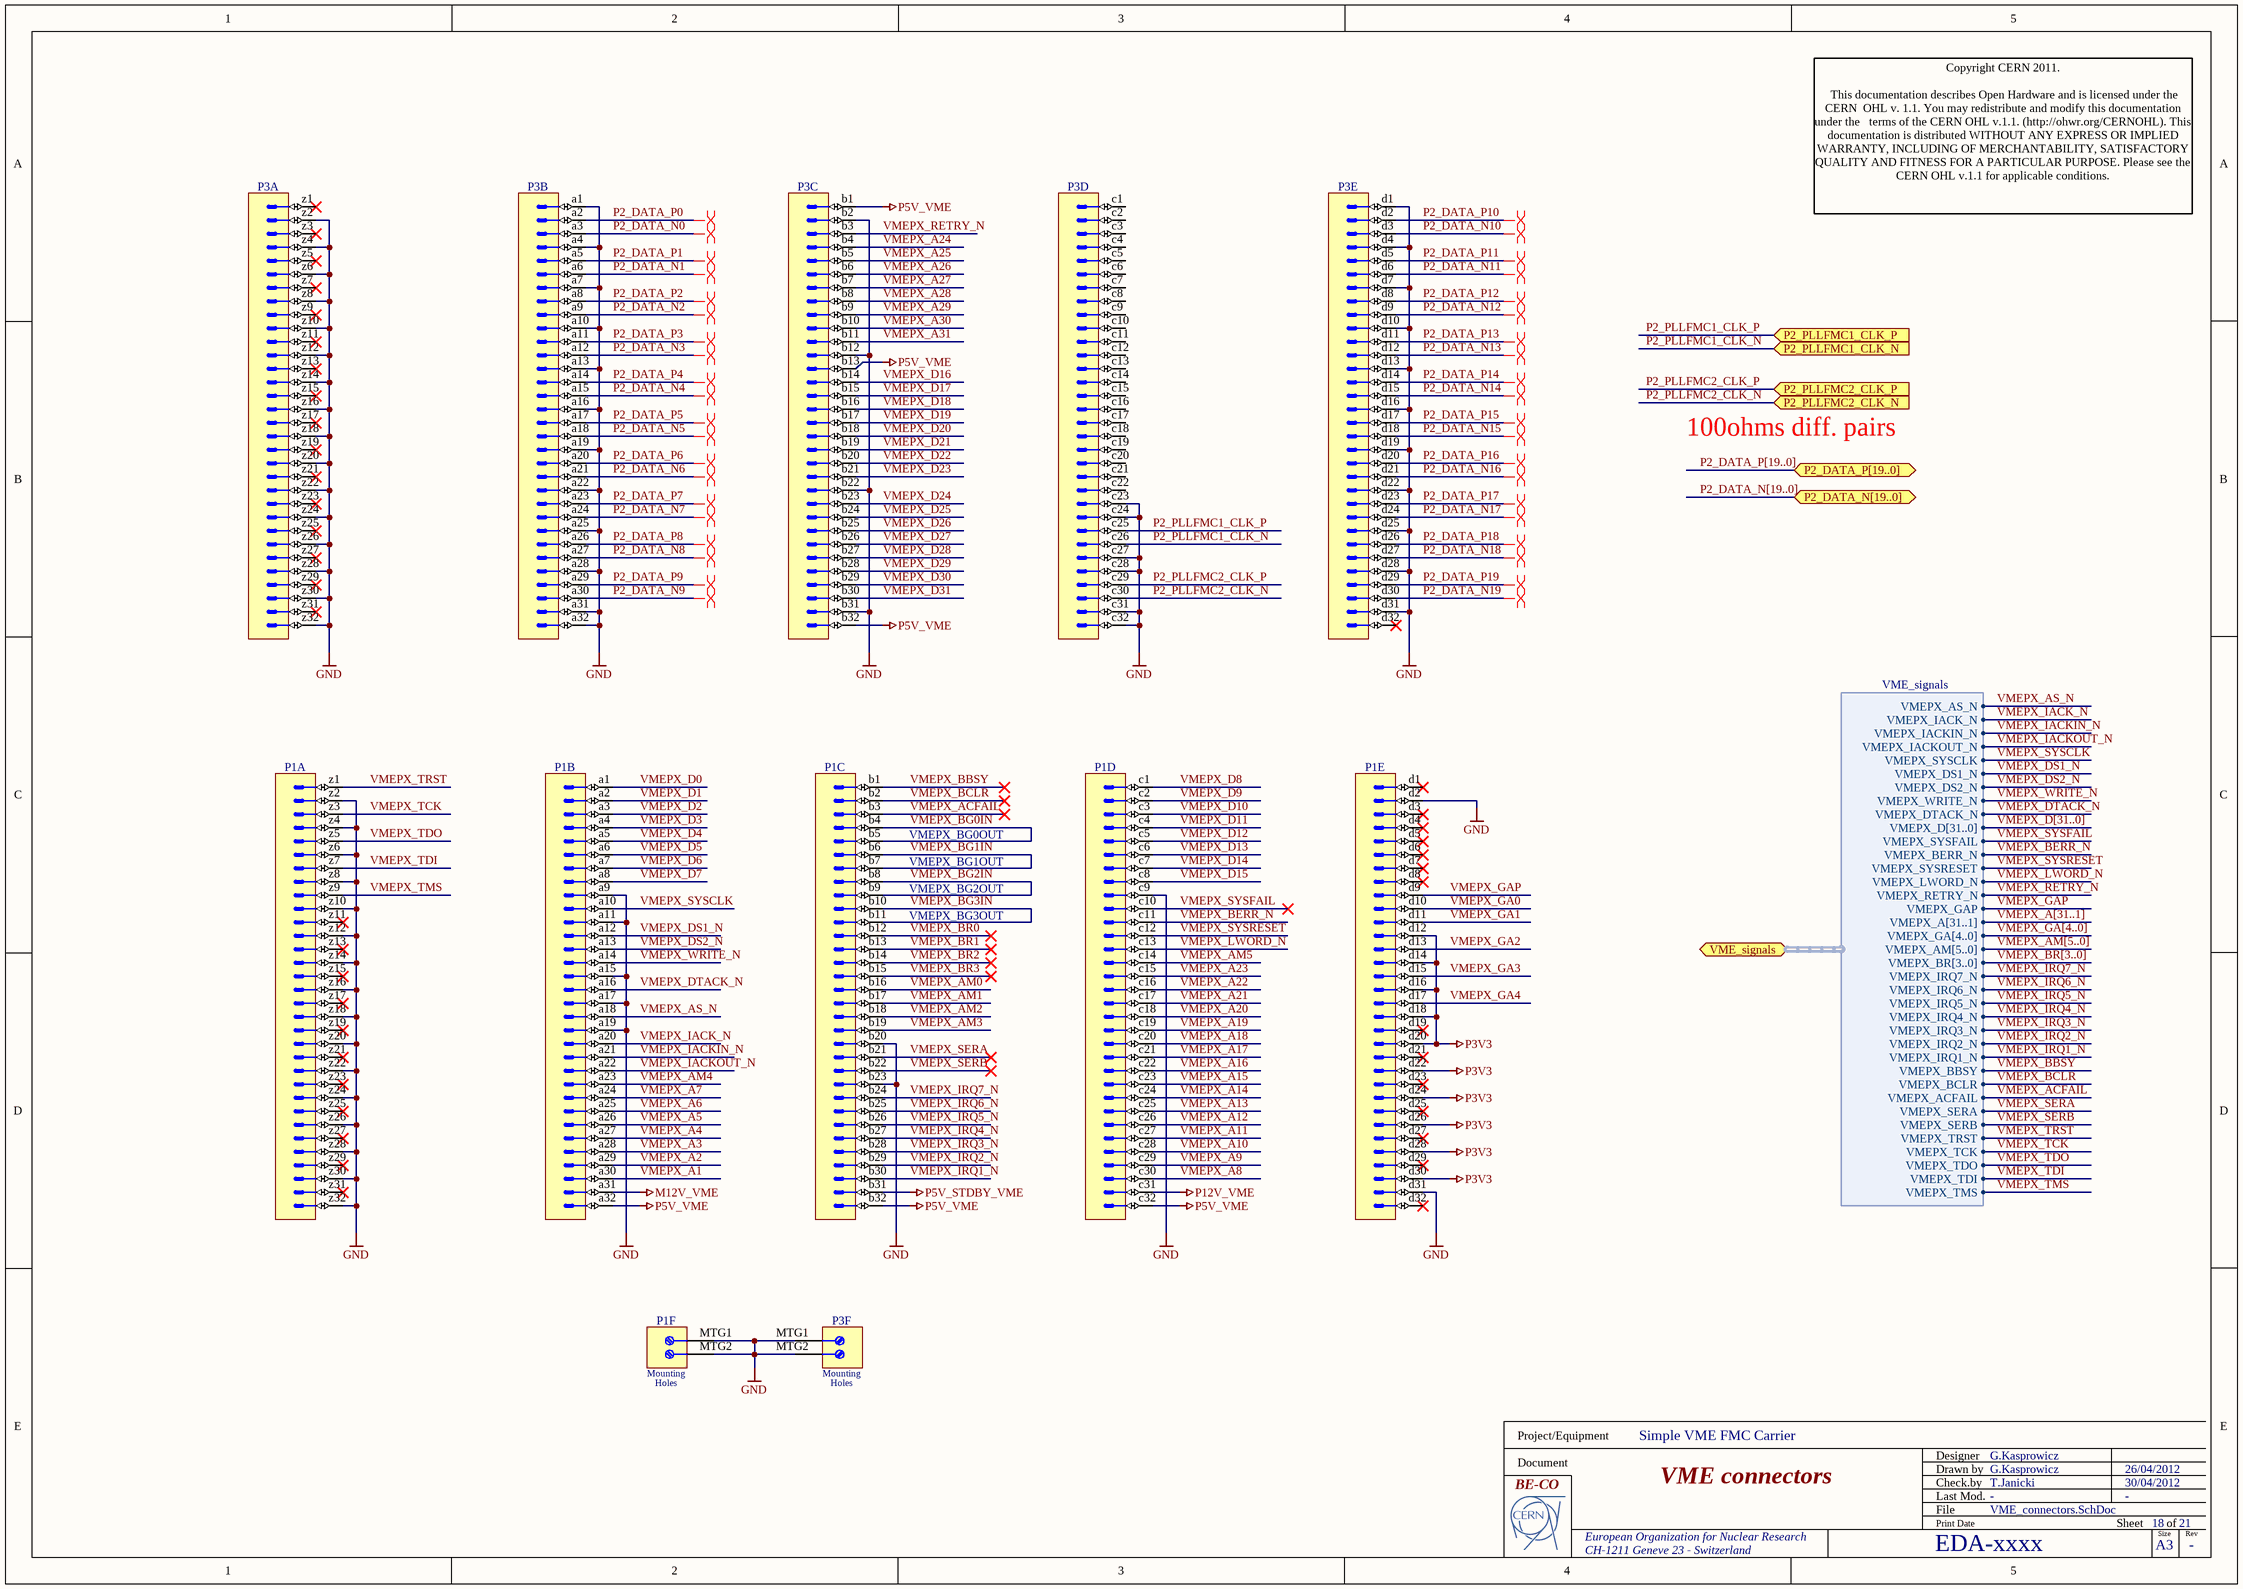
[diagram p13: VME_connectors.SchDoc]

### Parts
P1  HAR-BUS 64  [HARTING_02 01 160 2101]  (value not drawn)  (parts A,B,C,D,E,F of 6)
P3  HAR-BUS 64  [HARTING_02 01 160 2101]  (value not drawn)  (parts A,B,C,D,E,F of 6)

### Ports
P2_DATA_N[19..0] (bidir), P2_DATA_P[19..0] (bidir), P2_PLLFMC1_CLK_N (in), P2_PLLFMC1_CLK_P (in), P2_PLLFMC2_CLK_N (in), P2_PLLFMC2_CLK_P (in), VME_signals (harness VME_signals)

### Harnesses
VME_signals: VMEPX_AS_N, VMEPX_IACK_N, VMEPX_IACKIN_N, VMEPX_IACKOUT_N, VMEPX_SYSCLK, VMEPX_DS1_N, VMEPX_DS2_N, VMEPX_WRITE_N, VMEPX_DTACK_N, VMEPX_D[31..0], VMEPX_SYSFAIL, VMEPX_BERR_N, VMEPX_SYSRESET, VMEPX_LWORD_N, VMEPX_RETRY_N, VMEPX_GAP, VMEPX_A[31..1], VMEPX_GA[4..0], VMEPX_AM[5..0], VMEPX_BR[3..0], VMEPX_IRQ7_N, VMEPX_IRQ6_N, VMEPX_IRQ5_N, VMEPX_IRQ4_N, VMEPX_IRQ3_N, VMEPX_IRQ2_N, VMEPX_IRQ1_N, VMEPX_BBSY, VMEPX_BCLR, VMEPX_ACFAIL, VMEPX_SERA, VMEPX_SERB, VMEPX_TRST, VMEPX_TCK, VMEPX_TDO, VMEPX_TDI, VMEPX_TMS

### Nets
GND: P1.a9 P1.a11 P1.a15 P1.a17 P1.a19 P1.b20 P1.b23 P1.c9 P1.d2 P1.d31 P1.MTG1 P1.MTG2 P1.z2 P1.z4 P1.z6 P1.z8 P1.z10 P1.z12 P1.z14 P1.z16 P1.z18 P1.z20 P1.z22 P1.z24 P1.z26 P1.z28 P1.z30 P1.z32 P3.a1 P3.a4 P3.a7 P3.a10 P3.a13 P3.a16 P3.a19 P3.a22 P3.a25 P3.a28 P3.a31 P3.a32 P3.b2 P3.b12 P3.b22 P3.b31 P3.c23 P3.c24 P3.c27 P3.c28 P3.c31 P3.c32 P3.d1 P3.d4 P3.d7 P3.d10 P3.d13 P3.d16 P3.d19 P3.d22 P3.d25 P3.d28 P3.d31 P3.MTG1 P3.MTG2 P3.z2 P3.z4 P3.z6 P3.z8 P3.z10 P3.z12 P3.z14 P3.z16 P3.z18 P3.z20 P3.z22 P3.z24 P3.z26 P3.z28 P3.z30 P3.z32
M12V_VME: P1.a31
P3V3: P1.d12 P1.d14 P1.d16 P1.d18 P1.d20 P1.d22 P1.d24 P1.d26 P1.d28 P1.d30
P5V_STDBY_VME: P1.b31
P5V_VME: P1.a32 P1.b32 P1.c32 P3.b1 P3.b13 P3.b32
P12V_VME: P1.c31
P2_DATA_N0: P3.a3
P2_DATA_N1: P3.a6
P2_DATA_N2: P3.a9
P2_DATA_N3: P3.a12
P2_DATA_N4: P3.a15
P2_DATA_N5: P3.a18
P2_DATA_N6: P3.a21
P2_DATA_N7: P3.a24
P2_DATA_N8: P3.a27
P2_DATA_N9: P3.a30
P2_DATA_N10: P3.d3
P2_DATA_N11: P3.d6
P2_DATA_N12: P3.d9
P2_DATA_N13: P3.d12
P2_DATA_N14: P3.d15
P2_DATA_N15: P3.d18
P2_DATA_N16: P3.d21
P2_DATA_N17: P3.d24
P2_DATA_N18: P3.d27
P2_DATA_N19: P3.d30
P2_DATA_P0: P3.a2
P2_DATA_P1: P3.a5
P2_DATA_P2: P3.a8
P2_DATA_P3: P3.a11
P2_DATA_P4: P3.a14
P2_DATA_P5: P3.a17
P2_DATA_P6: P3.a20
P2_DATA_P7: P3.a23
P2_DATA_P8: P3.a26
P2_DATA_P9: P3.a29
P2_DATA_P10: P3.d2
P2_DATA_P11: P3.d5
P2_DATA_P12: P3.d8
P2_DATA_P13: P3.d11
P2_DATA_P14: P3.d14
P2_DATA_P15: P3.d17
P2_DATA_P16: P3.d20
P2_DATA_P17: P3.d23
P2_DATA_P18: P3.d26
P2_DATA_P19: P3.d29
P2_PLLFMC1_CLK_N: P3.c26 ; port P2_PLLFMC1_CLK_N
P2_PLLFMC1_CLK_P: P3.c25 ; port P2_PLLFMC1_CLK_P
P2_PLLFMC2_CLK_N: P3.c30 ; port P2_PLLFMC2_CLK_N
P2_PLLFMC2_CLK_P: P3.c29 ; port P2_PLLFMC2_CLK_P
VMEPX_A1: P1.a30
VMEPX_A2: P1.a29
VMEPX_A3: P1.a28
VMEPX_A4: P1.a27
VMEPX_A5: P1.a26
VMEPX_A6: P1.a25
VMEPX_A7: P1.a24
VMEPX_A8: P1.c30
VMEPX_A9: P1.c29
VMEPX_A10: P1.c28
VMEPX_A11: P1.c27
VMEPX_A12: P1.c26
VMEPX_A13: P1.c25
VMEPX_A14: P1.c24
VMEPX_A15: P1.c23
VMEPX_A16: P1.c22
VMEPX_A17: P1.c21
VMEPX_A18: P1.c20
VMEPX_A19: P1.c19
VMEPX_A20: P1.c18
VMEPX_A21: P1.c17
VMEPX_A22: P1.c16
VMEPX_A23: P1.c15
VMEPX_A24: P3.b4
VMEPX_A25: P3.b5
VMEPX_A26: P3.b6
VMEPX_A27: P3.b7
VMEPX_A28: P3.b8
VMEPX_A29: P3.b9
VMEPX_A30: P3.b10
VMEPX_A31: P3.b11
VMEPX_ACFAIL: P1.b3 ; port VME_signals.VMEPX_ACFAIL
VMEPX_AM0: P1.b16
VMEPX_AM1: P1.b17
VMEPX_AM2: P1.b18
VMEPX_AM3: P1.b19
VMEPX_AM4: P1.a23
VMEPX_AM5: P1.c14
VMEPX_AS_N: P1.a18 ; port VME_signals.VMEPX_AS_N
VMEPX_BBSY: P1.b1 ; port VME_signals.VMEPX_BBSY
VMEPX_BCLR: P1.b2 ; port VME_signals.VMEPX_BCLR
VMEPX_BERR_N: P1.c11 ; port VME_signals.VMEPX_BERR_N
VMEPX_BG0IN: P1.b4 P1.b5
VMEPX_BG1IN: P1.b6 P1.b7
VMEPX_BG2IN: P1.b8 P1.b9
VMEPX_BG3IN: P1.b10 P1.b11
VMEPX_BR0: P1.b12
VMEPX_BR1: P1.b13
VMEPX_BR2: P1.b14
VMEPX_BR3: P1.b15
VMEPX_D0: P1.a1
VMEPX_D1: P1.a2
VMEPX_D2: P1.a3
VMEPX_D3: P1.a4
VMEPX_D4: P1.a5
VMEPX_D5: P1.a6
VMEPX_D6: P1.a7
VMEPX_D7: P1.a8
VMEPX_D8: P1.c1
VMEPX_D9: P1.c2
VMEPX_D10: P1.c3
VMEPX_D11: P1.c4
VMEPX_D12: P1.c5
VMEPX_D13: P1.c6
VMEPX_D14: P1.c7
VMEPX_D15: P1.c8
VMEPX_D16: P3.b14
VMEPX_D17: P3.b15
VMEPX_D18: P3.b16
VMEPX_D19: P3.b17
VMEPX_D20: P3.b18
VMEPX_D21: P3.b19
VMEPX_D22: P3.b20
VMEPX_D23: P3.b21
VMEPX_D24: P3.b23
VMEPX_D25: P3.b24
VMEPX_D26: P3.b25
VMEPX_D27: P3.b26
VMEPX_D28: P3.b27
VMEPX_D29: P3.b28
VMEPX_D30: P3.b29
VMEPX_D31: P3.b30
VMEPX_DS1_N: P1.a12 ; port VME_signals.VMEPX_DS1_N
VMEPX_DS2_N: P1.a13 ; port VME_signals.VMEPX_DS2_N
VMEPX_DTACK_N: P1.a16 ; port VME_signals.VMEPX_DTACK_N
VMEPX_GA0: P1.d10
VMEPX_GA1: P1.d11
VMEPX_GA2: P1.d13
VMEPX_GA3: P1.d15
VMEPX_GA4: P1.d17
VMEPX_GAP: P1.d9 ; port VME_signals.VMEPX_GAP
VMEPX_IACK_N: P1.a20 ; port VME_signals.VMEPX_IACK_N
VMEPX_IACKIN_N: P1.a21 ; port VME_signals.VMEPX_IACKIN_N
VMEPX_IACKOUT_N: P1.a22 ; port VME_signals.VMEPX_IACKOUT_N
VMEPX_IRQ1_N: P1.b30 ; port VME_signals.VMEPX_IRQ1_N
VMEPX_IRQ2_N: P1.b29 ; port VME_signals.VMEPX_IRQ2_N
VMEPX_IRQ3_N: P1.b28 ; port VME_signals.VMEPX_IRQ3_N
VMEPX_IRQ4_N: P1.b27 ; port VME_signals.VMEPX_IRQ4_N
VMEPX_IRQ5_N: P1.b26 ; port VME_signals.VMEPX_IRQ5_N
VMEPX_IRQ6_N: P1.b25 ; port VME_signals.VMEPX_IRQ6_N
VMEPX_IRQ7_N: P1.b24 ; port VME_signals.VMEPX_IRQ7_N
VMEPX_LWORD_N: P1.c13 ; port VME_signals.VMEPX_LWORD_N
VMEPX_RETRY_N: P3.b3 ; port VME_signals.VMEPX_RETRY_N
VMEPX_SERA: P1.b21 ; port VME_signals.VMEPX_SERA
VMEPX_SERB: P1.b22 ; port VME_signals.VMEPX_SERB
VMEPX_SYSCLK: P1.a10 ; port VME_signals.VMEPX_SYSCLK
VMEPX_SYSFAIL: P1.c10 ; port VME_signals.VMEPX_SYSFAIL
VMEPX_SYSRESET: P1.c12 ; port VME_signals.VMEPX_SYSRESET
VMEPX_TCK: P1.z3 ; port VME_signals.VMEPX_TCK
VMEPX_TDI: P1.z7 ; port VME_signals.VMEPX_TDI
VMEPX_TDO: P1.z5 ; port VME_signals.VMEPX_TDO
VMEPX_TMS: P1.z9 ; port VME_signals.VMEPX_TMS
VMEPX_TRST: P1.z1 ; port VME_signals.VMEPX_TRST
VMEPX_WRITE_N: P1.a14 ; port VME_signals.VMEPX_WRITE_N

Not connected (* = marked no-connect by the designer): P1 d1* d3* d4* d5* d6* d7* d8* d19* d21* d23* d25* d27* d29* d32* z11* z13* z15* z17* z19* z21* z23* z25* z27* z29* z31*; P3 c1 c2 c3 c4 c5 c6 c7 c8 c9 c10 c11 c12 c13 c14 c15 c16 c17 c18 c19 c20 c21 c22 d32* z1* z3* z5* z7* z9* z11* z13* z15* z17* z19* z21* z23* z25* z27* z29* z31*

### Buses and harness runs
bus P2_DATA_N[19..0] = port P2_DATA_N[19..0]
bus P2_DATA_P[19..0] = port P2_DATA_P[19..0]
bus VMEPX_A[31..1]
bus VMEPX_AM[5..0]
bus VMEPX_BR[3..0]
bus VMEPX_D[31..0]
bus VMEPX_GA[4..0]

### Layout directives
differential pair: P2_DATA_N0, P2_DATA_N1, P2_DATA_N2, P2_DATA_N3, P2_DATA_N4, P2_DATA_N5, P2_DATA_N6, P2_DATA_N7, P2_DATA_N8, P2_DATA_N9, P2_DATA_N10, P2_DATA_N11, P2_DATA_N12, P2_DATA_N13, P2_DATA_N14, P2_DATA_N15, P2_DATA_N16, P2_DATA_N17, P2_DATA_N18, P2_DATA_N19, P2_DATA_P0, P2_DATA_P1, P2_DATA_P2, P2_DATA_P3, P2_DATA_P4, P2_DATA_P5, P2_DATA_P6, P2_DATA_P7, P2_DATA_P8, P2_DATA_P9, P2_DATA_P10, P2_DATA_P11, P2_DATA_P12, P2_DATA_P13, P2_DATA_P14, P2_DATA_P15, P2_DATA_P16, P2_DATA_P17, P2_DATA_P18, P2_DATA_P19

### Notes on the sheet
- Copyright CERN 2011.
  This documentation describes Open Hardware and is licensed under the CERN  OHL v. 1.1. You may redistribute and modify this documentation under the   terms of the CERN OHL v.1.1. (http://ohwr.org/CERNOHL). This  documentation is distributed WITHOUT ANY EXPRESS OR IMPLIED  WARRANTY, INCLUDING OF MERCHANTABILITY, SATISFACTORY  QUALITY AND FITNESS FOR A PARTICULAR PURPOSE. Please see the  CERN OHL v.1.1 for applicable conditions.
- 100ohms diff. pairs
- VMEPX_BG0OUT
- VMEPX_BG1OUT
- VMEPX_BG2OUT
- VMEPX_BG3OUT
- Project/Equipment
- Document
- Designer
- Drawn by
- Check.by
- File
- Last Mod.
- Print Date
- Sheet
- Size
- A3
- of
- Rev
- (in symbol HARTING_02 01 160 2101, part F) Mounting; Holes

### Library data of the parts
P1 P3 = HARTING_02 01 160 2101: Connector 160zabcd Male (5x32); Part Description: DIN 41612, har-bus 64, 160 poles,5 Rows z+a+b+c+d, Angled solder pins, Male contacts, Pitch 2.54mm; Part Number: HARTING_02 01 160 2101; Component Kind: Standard; Component Type: Standard; Pin Count: 162; Family: HAR-BUS 64; Mounted: Yes; Socket: No; SMD: No; Manufacturer: HARTING; Manufacturer Part Number: 02 01 160 2101; ComponentHeight: 11.1mm; HelpURL: \\cern.ch\dfs\Applications\Altium\Datasheets\HARTING_02 01 160 2101.pdf; Author: CERN DEM JLC; CreateDate: 26/11/2008; LatestRevisionDate: 26/11/2008; Table: HARTING